# EAGLE design ALog-BottleLogger (EAGLE 9.1.3)

## Sheet 1 of 7: MAIN
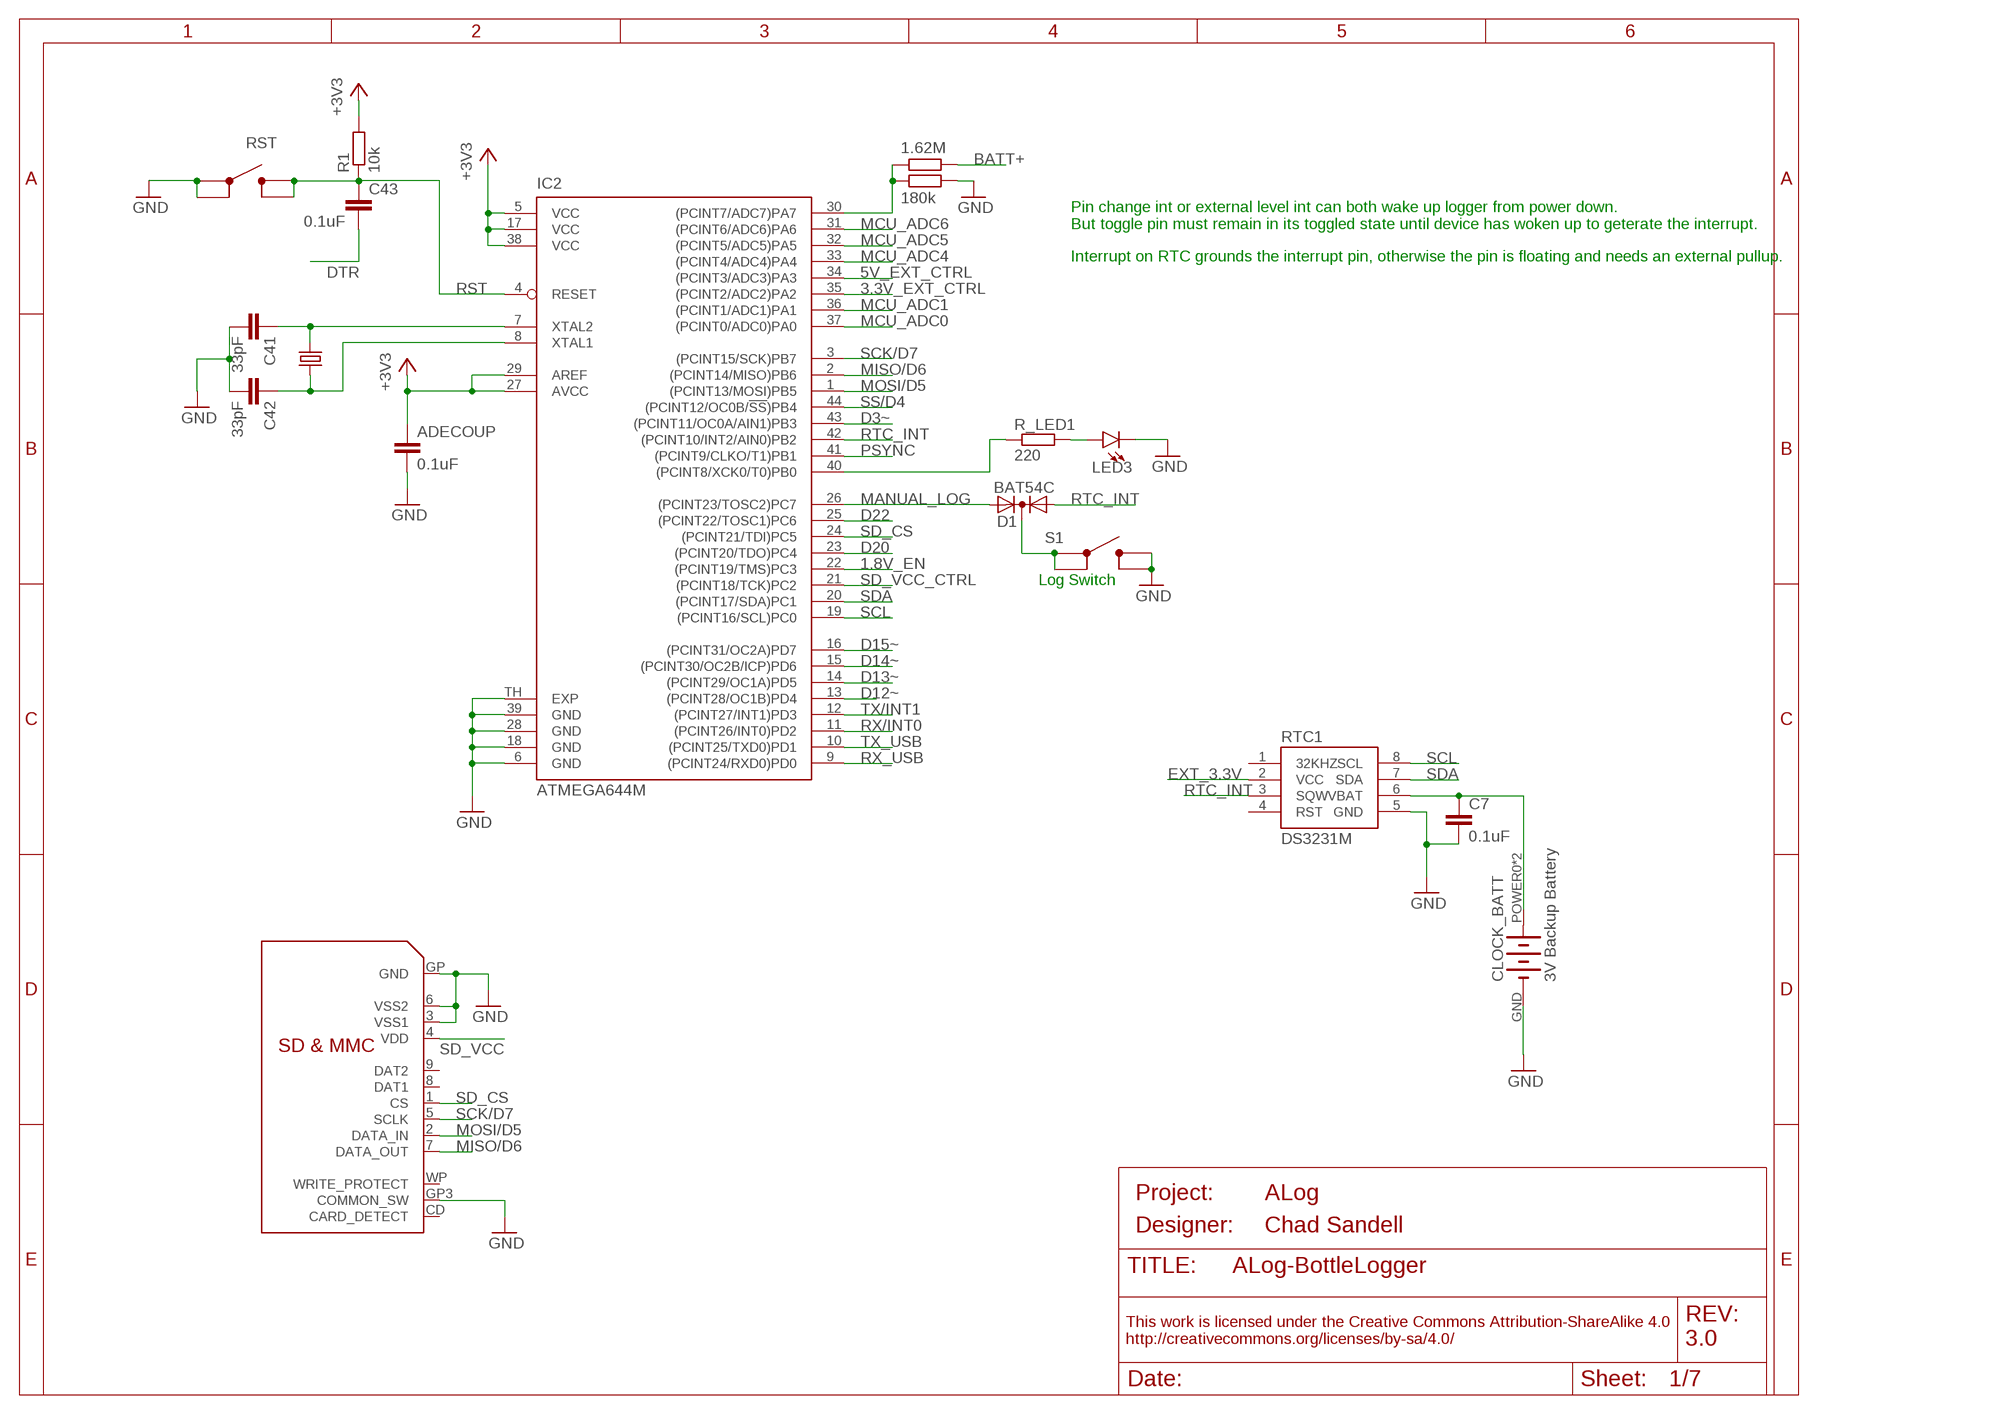
[diagram p0: schematic, sheet 1]
FRAME1 (FRAME_A_L): DESIGNER: Chad Sandell; PROJECT: ALog; REV: 3.0

### Parts
ADECOUP  0.1uF  C-EU0.1UFC0603  [C0603]
C7  0.1uF  C-EU0.1UFC0603  [C0603]
C41  33pF  C-EUC0603  [C0603]
C42  33pF  C-EUC0603  [C0603]
C43  0.1uF  C-EU0.1UFC0603  [C0603]
CLOCK_BATT  3V Backup Battery  LINX-BAT-HLD-012-SMT-OTL  [LINX_BAT-HLD-012-SMT]
D1  BAT54C  DIODE_AC-CA_  [SOT23C]
IC2  ATMEGA644M  [MLF44-TH]
LED3  LED1206  [LED-1206]
Q3  CRYSTALHC49UP  [HC49UP]
R1  10k  R-EU_10KR0603  [R0603]
R18  1.62M  R-EU_1.62MR0603  [R0603]
R19  180k  R-EU_180KR0603  [R0603]
R_LED1  220  R-EU_R0603  [R0603]
RTC1  DS3231M  [SO08]
S1  SWITCHC&K_400GF  [SWITCH_4.2X3.2]
SD  SDMMC06132  [06132]
U$4  SWITCHC&K_400GF  [SWITCH_4.2X3.2]

### Nets
1.8V_EN: IC2.22((PCINT19/TMS)PC3) ; also sheet 3
3.3V_EXT_CTRL: IC2.35((PCINT2/ADC2)PA2) ; also sheet 5
5V_EXT_CTRL: IC2.34((PCINT3/ADC3)PA3) ; also sheet 5
+3V3: ADECOUP.1 IC2.5(VCC) IC2.17(VCC) IC2.27(AVCC) IC2.29(AREF) IC2.38(VCC) R1.2 ; also sheet 3,5,6,7
ADC16: IC2.30((PCINT7/ADC7)PA7) R18.1 R19.1
BATT+: R18.2 ; also sheet 3,6
D3~: IC2.43((PCINT11/OC0A/AIN1)PB3) ; also sheet 6
D12~: IC2.13((PCINT28/OC1B)PD4) ; also sheet 6
D13~: IC2.14((PCINT29/OC1A)PD5) ; also sheet 6
D14~: IC2.15((PCINT30/OC2B/ICP)PD6) ; also sheet 6
D15~: IC2.16((PCINT31/OC2A)PD7) ; also sheet 6
D20: IC2.23((PCINT20/TDO)PC4)
D22: IC2.25((PCINT22/TOSC1)PC6)
DTR: C43.2 ; also sheet 4
EXT_3.3V: RTC1.2(VCC) ; also sheet 5,6
GND: ADECOUP.2 C7.2 C41.2 C42.2 CLOCK_BATT.GND(-) IC2.6(GND) IC2.18(GND) IC2.28(GND) IC2.39(GND) IC2.TH(EXP) LED3.C R19.2 RTC1.5(GND) S1.P$3 S1.P$4 SD.3(VSS1) SD.6(VSS2) SD.GP3(COMMON_SW) SD.GP(GND) U$4.P$1 U$4.P$2 ; also sheet 2,3,4,5,6,7
LED+1: LED3.A R_LED1.2
MANUAL_LOG: D1.2(A2) IC2.26((PCINT23/TOSC2)PC7)
MCU_ADC0: IC2.37((PCINT0/ADC0)PA0) ; also sheet 6
MCU_ADC1: IC2.36((PCINT1/ADC1)PA1)
MCU_ADC4: IC2.33((PCINT4/ADC4)PA4)
MCU_ADC5: IC2.32((PCINT5/ADC5)PA5)
MCU_ADC6: IC2.31((PCINT6/ADC6)PA6)
MISO/D6: IC2.2((PCINT14/MISO)PB6) SD.7(DATA_OUT) ; also sheet 6
MOSI/D5: IC2.1((PCINT13/MOSI)PB5) SD.2(DATA_IN) ; also sheet 6
N$5: IC2.40((PCINT8/XCK0/T0)PB0) R_LED1.1
N$37: C7.1 CLOCK_BATT.POWER0(+) CLOCK_BATT.POWER1(+) RTC1.6(VBAT)
N$39: D1.3(K) S1.P$1 S1.P$2
PSYNC: IC2.41((PCINT9/CLKO/T1)PB1) ; also sheet 3
RST: C43.1 IC2.4(RESET) R1.1 U$4.P$3 U$4.P$4 ; also sheet 6
RTC_INT: D1.1(A1) IC2.42((PCINT10/INT2/AIN0)PB2) RTC1.3(SQW)
RX/INT0: IC2.11((PCINT26/INT0)PD2) ; also sheet 6
RX_USB: IC2.9((PCINT24/RXD0)PD0) ; also sheet 4
SCK/D7: IC2.3((PCINT15/SCK)PB7) SD.5(SCLK) ; also sheet 6
SCL: IC2.19((PCINT16/SCL)PC0) RTC1.8(SCL) ; also sheet 6,7
SD_CS: IC2.24((PCINT21/TDI)PC5) SD.1(CS)
SD_VCC: SD.4(VDD) ; also sheet 5
SD_VCC_CTRL: IC2.21((PCINT18/TCK)PC2) ; also sheet 5
SDA: IC2.20((PCINT17/SDA)PC1) RTC1.7(SDA) ; also sheet 6,7
SS/D4: IC2.44((PCINT12/OC0B/!SS!)PB4) ; also sheet 6
TX/INT1: IC2.12((PCINT27/INT1)PD3) ; also sheet 6
TX_USB: IC2.10((PCINT25/TXD0)PD1) ; also sheet 4
XTAL1: C42.1 IC2.8(XTAL1) Q3.1
XTAL2: C41.1 IC2.7(XTAL2) Q3.2
Unconnected: RTC1.1(32KHZ) RTC1.4(RST) SD.8(DAT1) SD.9(DAT2) SD.CD(CARD_DETECT) SD.WP(WRITE_PROTECT)

### Notes on the sheet
- Pin change int or external level int can both wake up logger from power down.  
  But toggle pin must remain in its toggled state until device has woken up to geterate the interrupt.
- Interrupt on RTC grounds the interrupt pin, otherwise the pin is floating and needs an external pullup.
- Log Switch

## Sheet 2 of 7: ADC REFERENCE
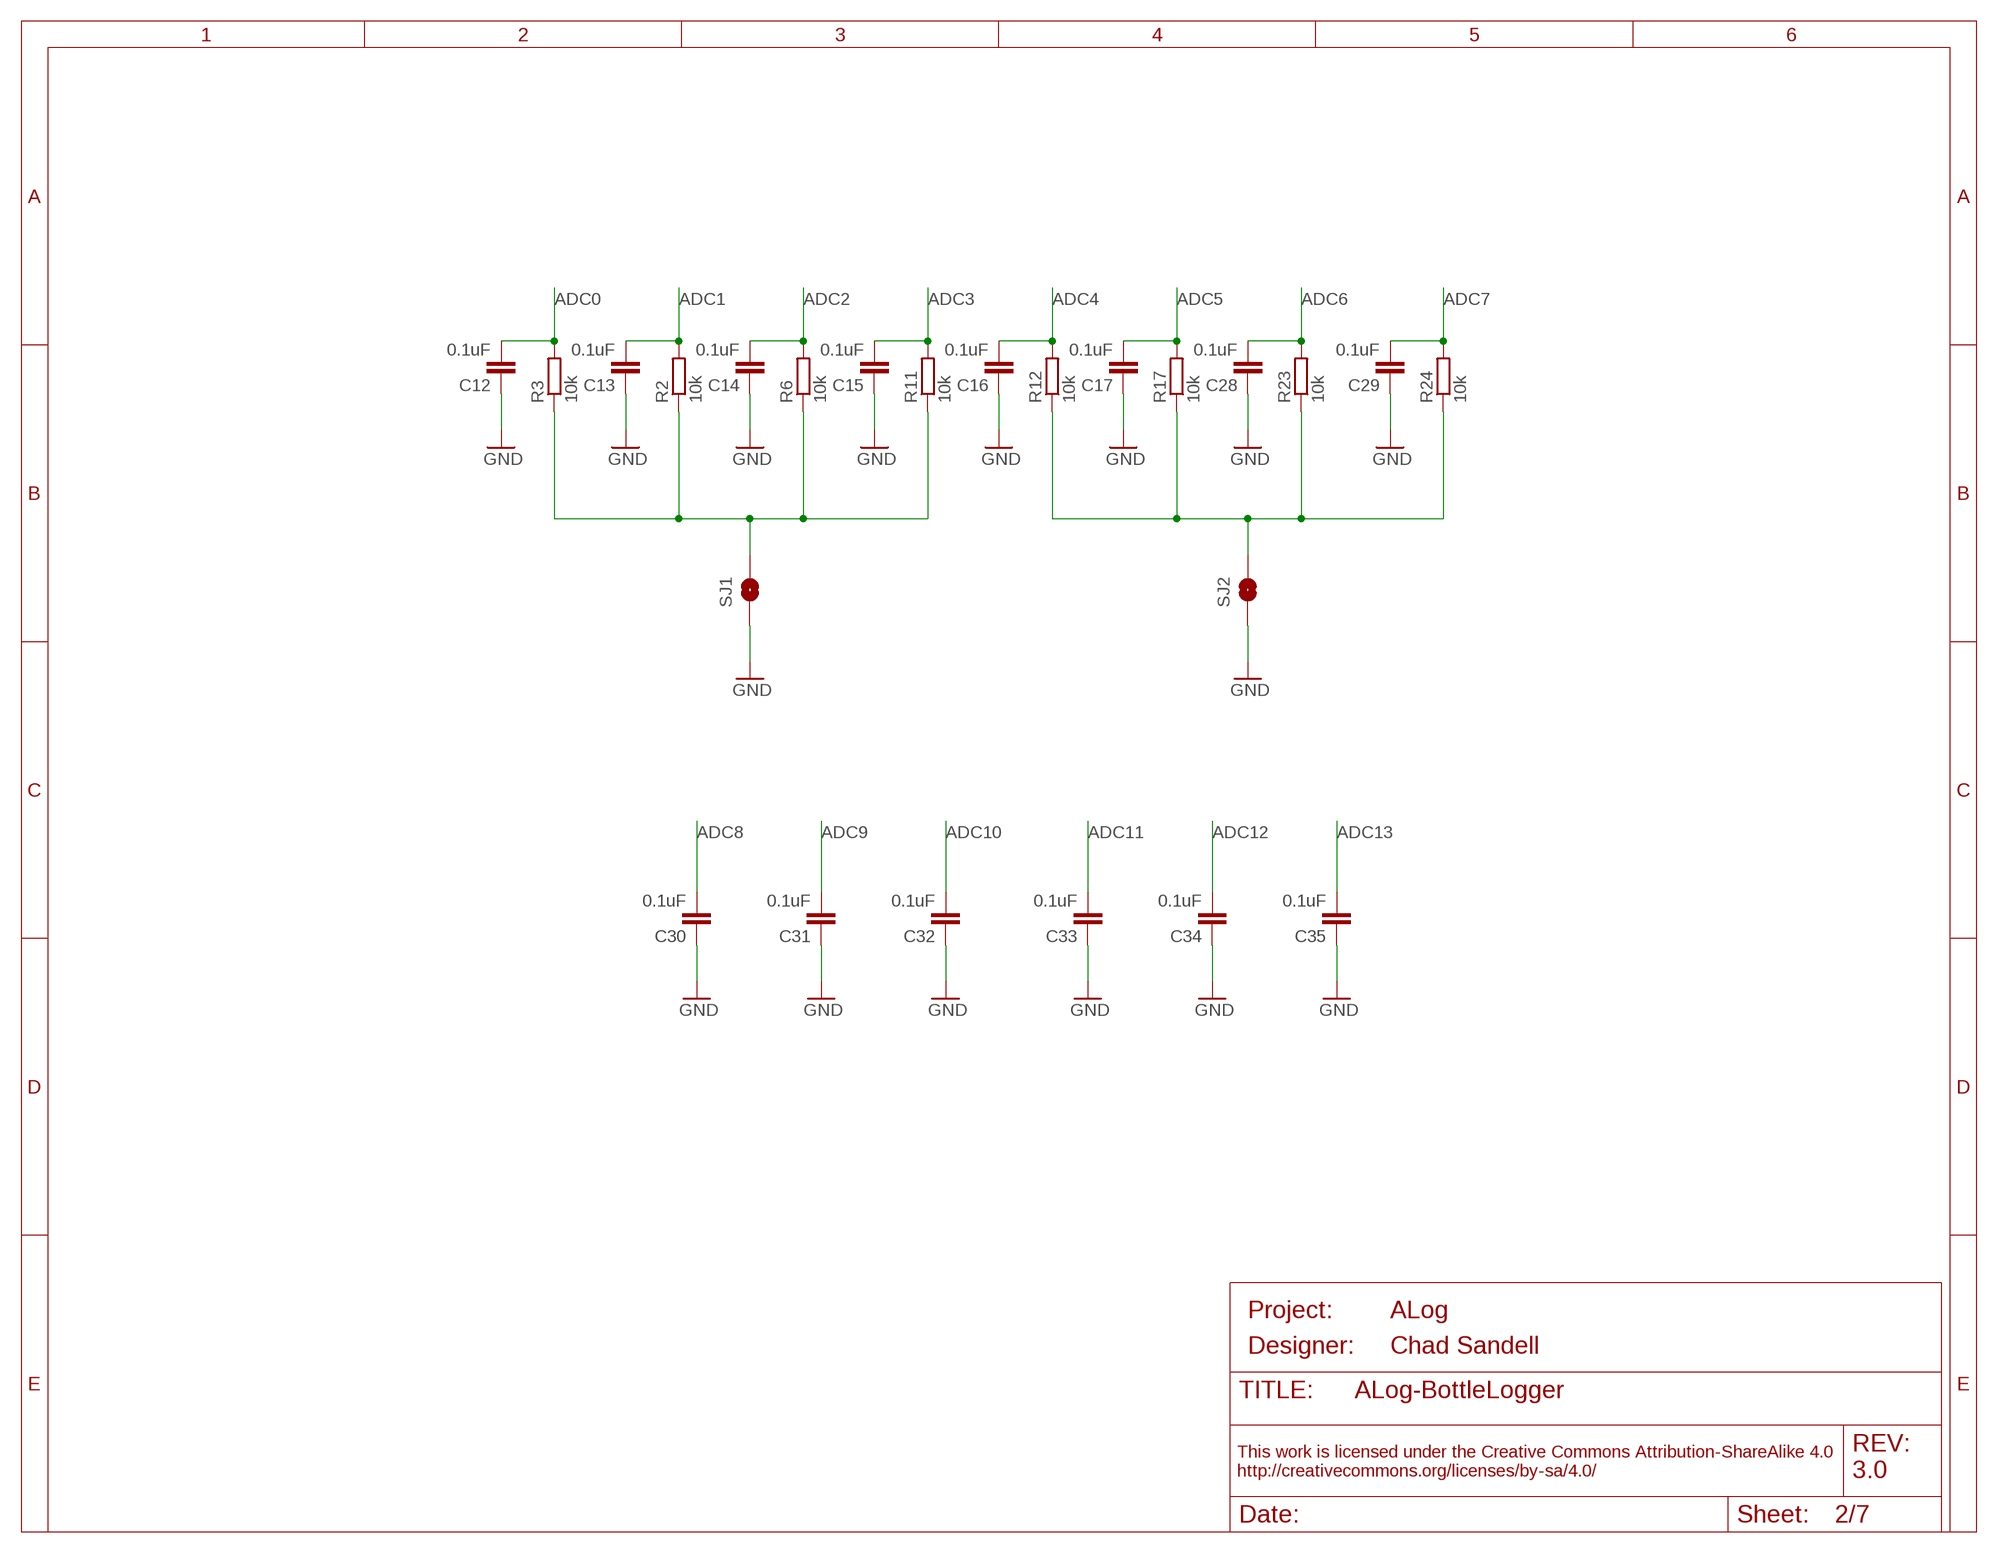
[diagram p1: schematic, sheet 2]
FRAME2 (FRAME_A_L): DESIGNER: Chad Sandell; PROJECT: ALog; REV: 3.0

### Parts
C12  0.1uF  C-EUC0603  [C0603]
C13  0.1uF  C-EU0.1UFC0603  [C0603]
C14  0.1uF  C-EUC0603  [C0603]
C15  0.1uF  C-EU0.1UFC0603  [C0603]
C16  0.1uF  C-EU0.1UFC0603  [C0603]
C17  0.1uF  C-EU0.1UFC0603  [C0603]
C28  0.1uF  C-EU0.1UFC0603  [C0603]
C29  0.1uF  C-EU0.1UFC0603  [C0603]
C30  0.1uF  C-EU0.1UFC0603  [C0603]
C31  0.1uF  C-EU0.1UFC0603  [C0603]
C32  0.1uF  C-EU0.1UFC0603  [C0603]
C33  0.1uF  C-EU0.1UFC0603  [C0603]
C34  0.1uF  C-EU0.1UFC0603  [C0603]
C35  0.1uF  C-EU0.1UFC0603  [C0603]
R2  10k  R-EU_10KR0603  [R0603]
R3  10k  R-EU_10KR0603  [R0603]
R6  10k  R-EU_10KR0603  [R0603]
R11  10k  R-EU_10KR0603  [R0603]
R12  10k  R-EU_10KR0603  [R0603]
R17  10k  R-EU_10KR0603  [R0603]
R23  10k  R-EU_10KR0603  [R0603]
R24  10k  R-EU_10KR0603  [R0603]
SJ1  SOLDERJUMPER-OLDTRACE  [SJ_2S-TRACE]
SJ2  SOLDERJUMPER-OLDTRACE  [SJ_2S-TRACE]

### Nets
ADC0: C12.2 R3.2 ; also sheet 6,7
ADC1: C13.2 R2.2 ; also sheet 6,7
ADC2: C14.2 R6.2 ; also sheet 6,7
ADC3: C15.2 R11.2 ; also sheet 6,7
ADC4: C16.2 R12.2 ; also sheet 6,7
ADC5: C17.2 R17.2 ; also sheet 6,7
ADC6: C28.2 R23.2 ; also sheet 6,7
ADC7: C29.2 R24.2 ; also sheet 6,7
ADC8: C30.2 ; also sheet 6,7
ADC9: C31.2 ; also sheet 6,7
ADC10: C32.2 ; also sheet 6,7
ADC11: C33.2 ; also sheet 6,7
ADC12: C34.2 ; also sheet 6,7
ADC13: C35.2 ; also sheet 6,7
GND: C12.1 C13.1 C14.1 C15.1 C16.1 C17.1 C28.1 C29.1 C30.1 C31.1 C32.1 C33.1 C34.1 C35.1 SJ1.1 SJ2.1 ; also sheet 1,3,4,5,6,7
N$18: R12.1 R17.1 R23.1 R24.1 SJ2.2
N$24: R2.1 R3.1 R6.1 R11.1 SJ1.2

## Sheet 3 of 7: POWER REGULATION
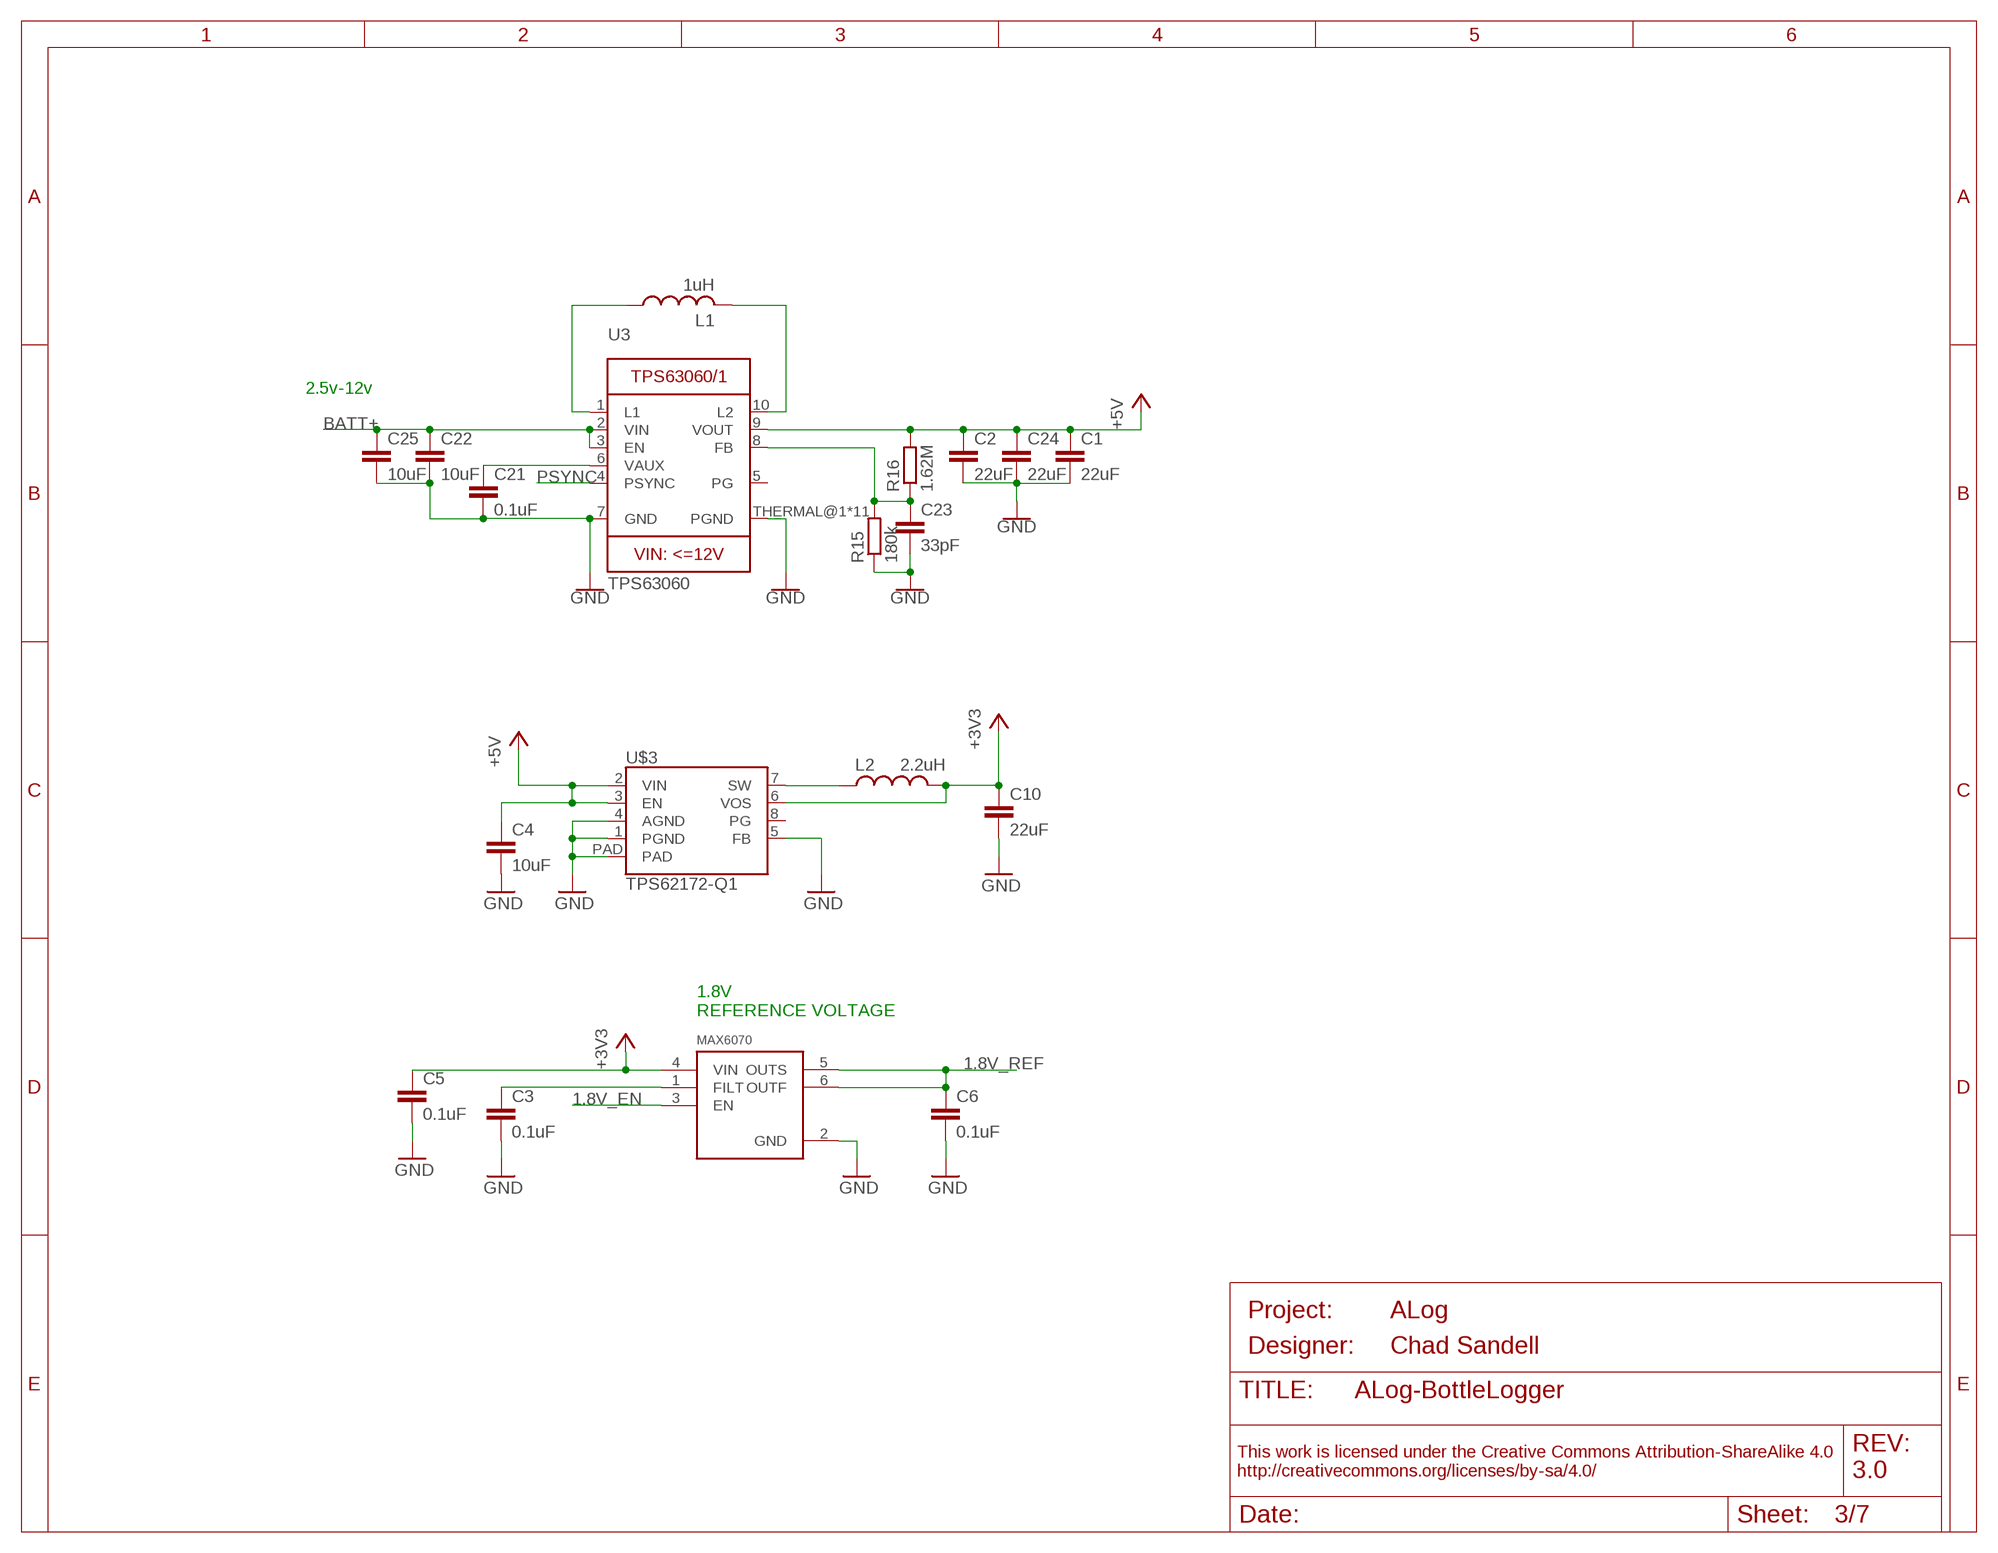
[diagram p2: schematic, sheet 3]
FRAME3 (FRAME_A_L): DESIGNER: Chad Sandell; PROJECT: ALog; REV: 3.0

### Parts
C1  22uF  C-EU22UFC0805  [C0805]
C2  22uF  C-EU22UFC0805  [C0805]
C3  0.1uF  C-EU0.1UFC0603  [C0603]
C4  10uF  C-EU10UFC0805  [C0805]
C5  0.1uF  C-EUC0603  [C0603]
C6  0.1uF  C-EUC0603  [C0603]
C10  22uF  C-EU22UFC0805  [C0805]
C21  0.1uF  C-EUC0603  [C0603]
C22  10uF  C-EU10UFC0805  [C0805]
C23  33pF  C-EUC0603  [C0603]
C24  22uF  C-EU22UFC0805  [C0805]
C25  10uF  C-EU10UFC0805  [C0805]
L1  1uH  WE-MAIA(INDUCTOR)  [WE-MAIA(4.1X4.1)]
L2  2.2uH  INDUCTOR0806  [0806]
R15  180k  R-EU_180KR0603  [R0603]
R16  1.62M  R-EU_1.62MR0603  [R0603]
U3  TPS63060  [PWSON-N10]
U$2  MAX6070AAUT18  [SOT23-6L]
U$3  TPS62172-Q1  [WSON-8-PAD]

### Nets
1.8V_EN: U$2.3(EN) ; also sheet 1
1.8V_REF: C6.1 U$2.5(OUTS) U$2.6(OUTF) ; also sheet 7
+3V3: C5.1 C10.1 L2.P$2 U$2.4(VIN) U$3.6(VOS) ; also sheet 1,5,6,7
+5V: C1.1 C2.1 C4.1 C24.1 R16.2 U3.9(VOUT) U$3.2(VIN) U$3.3(EN) ; also sheet 4,5,7
BATT+: C22.1 C25.1 U3.2(VIN) U3.3(EN) ; also sheet 1,6
GND: C1.2 C2.2 C3.2 C4.2 C5.2 C6.2 C10.2 C21.2 C22.2 C23.2 C24.2 C25.2 R15.1 U3.7(GND) U3.THERMAL@1(PGND) U3.THERMAL@5(PGND) U3.THERMAL@6(PGND) U3.THERMAL@7(PGND) U3.THERMAL@8(PGND) U3.THERMAL@9(PGND) U3.THERMAL@10(PGND) U3.THERMAL@11(PGND) U3.THERMAL@12(PGND) U3.THERMAL@13(PGND) U3.THERMAL@14(PGND) U$2.2(GND) U$3.1(PGND) U$3.4(AGND) U$3.5(FB) U$3.PAD ; also sheet 1,2,4,5,6,7
N$1: L2.P$1 U$3.7(SW)
N$21: C21.1 U3.6(VAUX)
N$22: C23.1 R15.2 R16.1 U3.8(FB)
N$27: L1.P$1 U3.1(L1)
N$32: L1.P$2 U3.10(L2)
N$40: C3.1 U$2.1(FILT)
PSYNC: U3.4(PSYNC) ; also sheet 1
Unconnected: U3.5(PG) U$3.8(PG)

### Notes on the sheet
- 2.5v-12v
- 1.8V
  REFERENCE VOLTAGE

## Sheet 4 of 7: USB
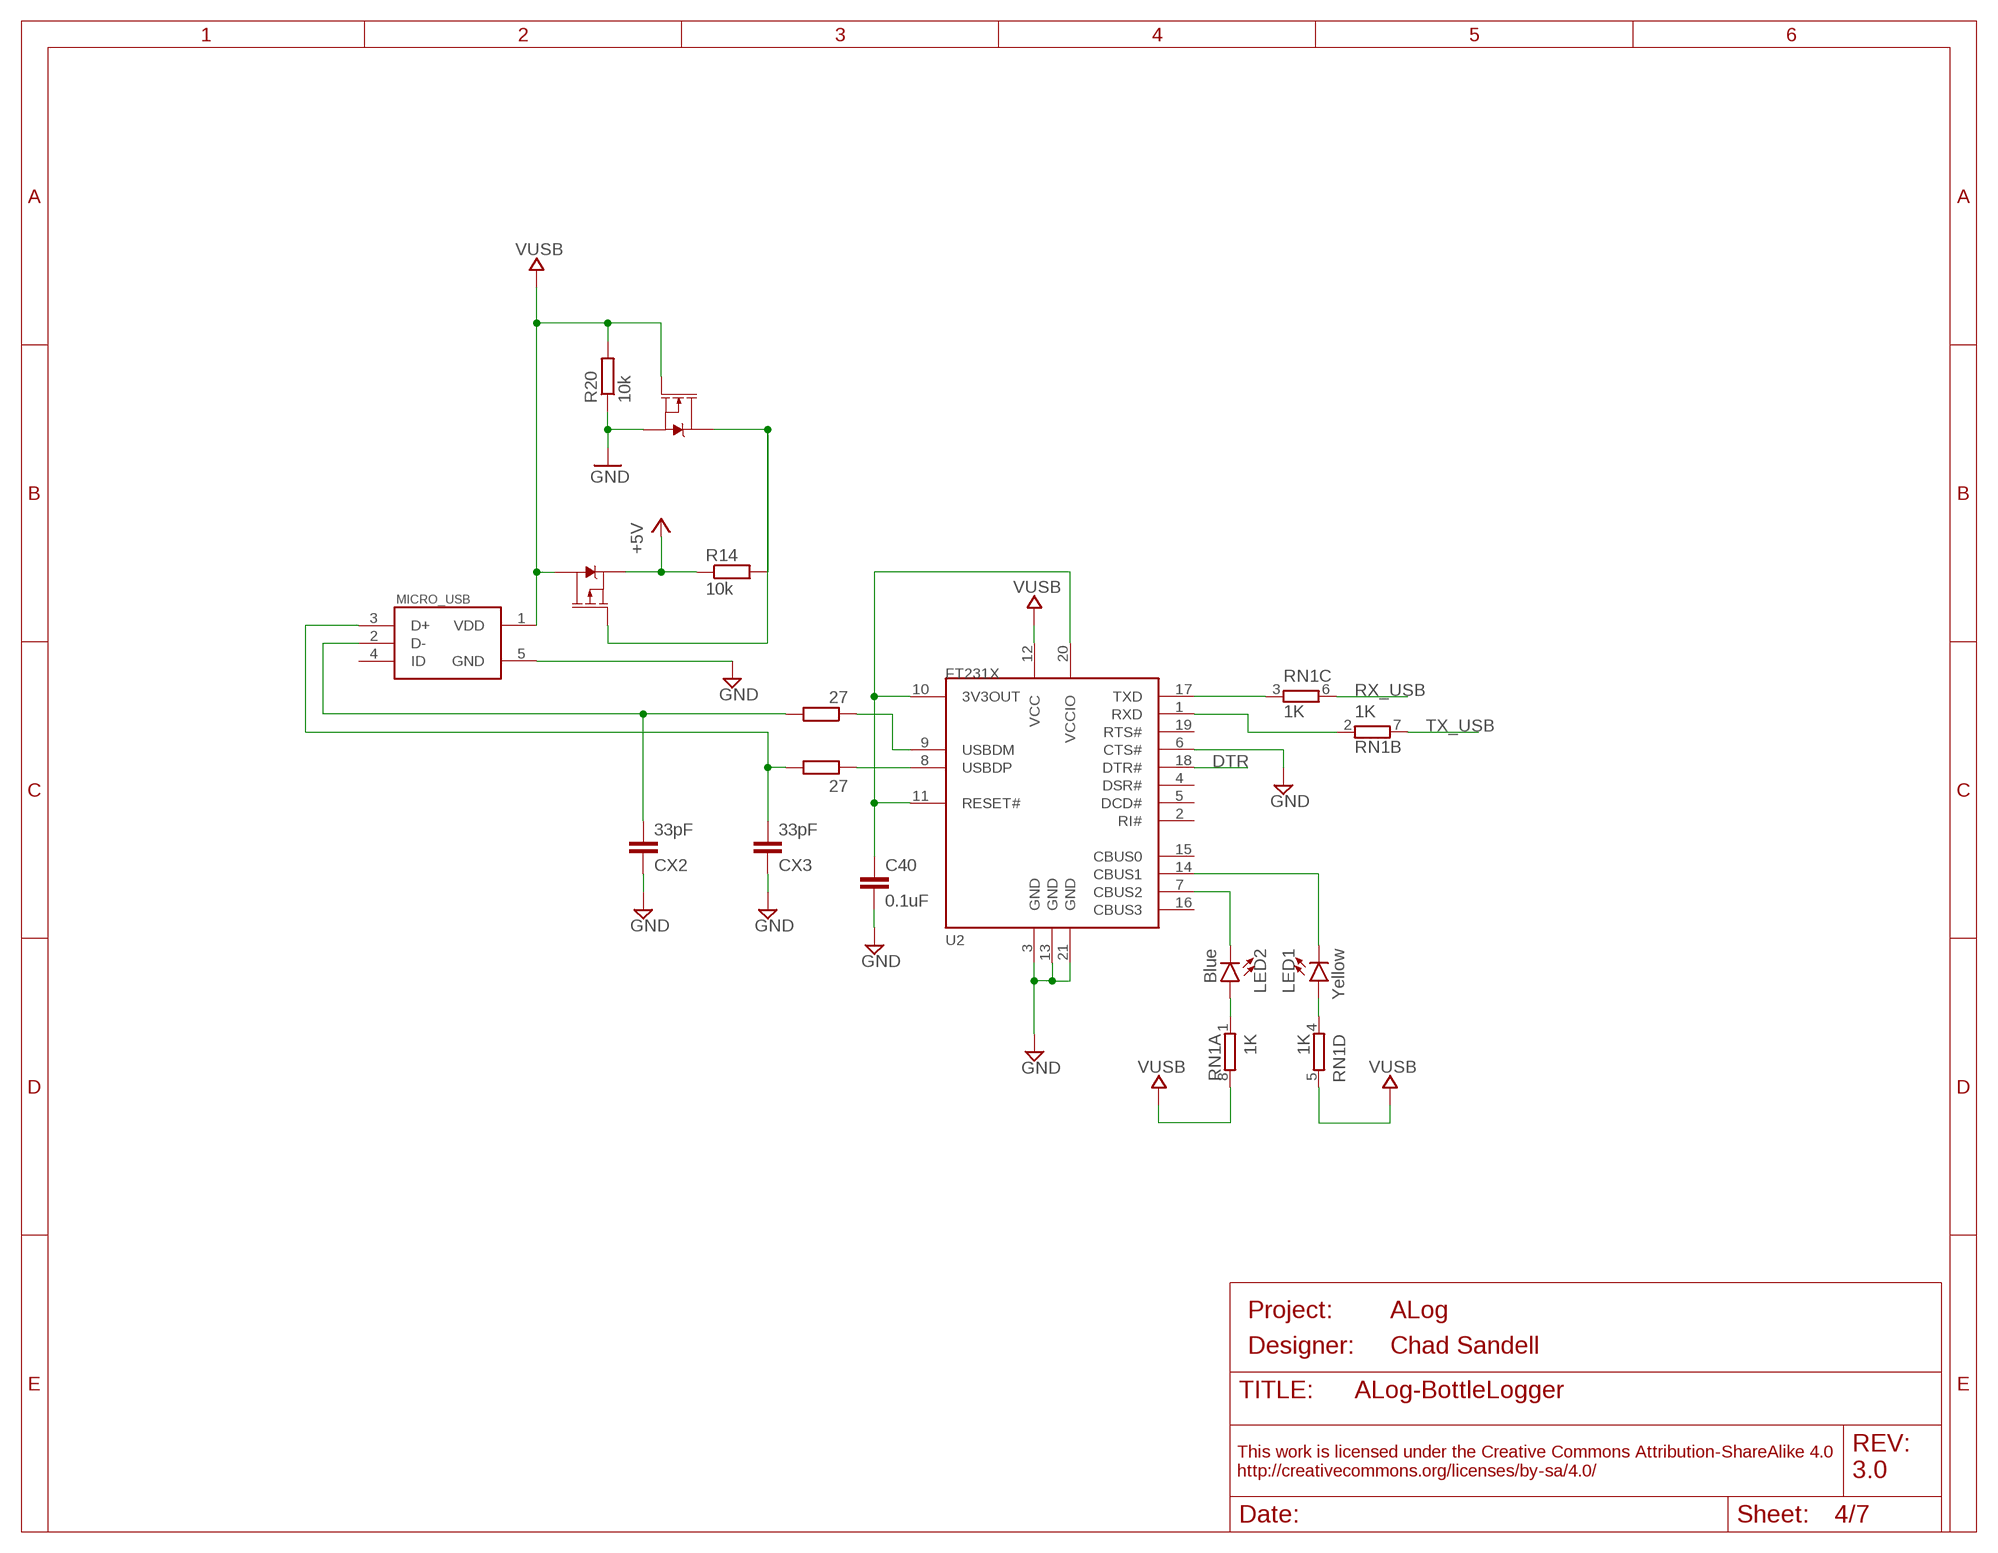
[diagram p3: schematic, sheet 4]
FRAME4 (FRAME_A_L): DESIGNER: Chad Sandell; PROJECT: ALog; REV: 3.0

### Parts
C40  0.1uF  C-EU0.1UFC0603  [C0603]
CX2  33pF  C-EUC0603  [C0603]
CX3  33pF  C-EUC0603  [C0603]
D+  27  R-EU_27R0603  [R0603]
D-  27  R-EU_27R0603  [R0603]
LED1  Yellow  LED0603  [LED-0603]
LED2  Blue  LED0603  [LED-0603]
MICRO_USB  MICRO_USB_LONGPADS  [10118194-0001LF_10118194-0001LF_LONGER_PADS]
Q11  310mA/60V/1.6Ω  MOSFET-NCH-2N7002PW  [SOT323]
Q12  FDN360P  MOSFET_PCH-FDN360P  [SOT23-3]
R14  10k  R-EU_R0603  [R0603]
R20  10k  R-EU_R0603  [R0603]
RN1  1K  4R-N0603-ARC  [0603-ARC]
U2  FT231X-Q  [QFN20]

### Nets
+5V: Q12.2(S) R14.1 ; also sheet 3,5,7
DTR: U2.18(DTR#) ; also sheet 1
GND: C40.2 CX2.1 CX3.1 MICRO_USB.5(GND) Q11.2(S) R20.1 U2.3(GND) U2.6(CTS#) U2.13(GND) U2.21(GND) ; also sheet 1,2,3,5,6,7
N$2: LED2.A RN1.1
N$3: LED1.A RN1.4
N$4: RN1.3 U2.17(TXD)
N$11: Q11.3(D) Q12.1(G) R14.2
N$25: CX3.2 D+.2 MICRO_USB.3(D+)
N$26: CX2.2 D-.2 MICRO_USB.2(D-)
N$28: D+.1 U2.8(USBDP)
N$29: RN1.2 U2.1(RXD)
N$30: C40.1 U2.10(3V3OUT) U2.11(RESET#) U2.20(VCCIO)
N$33: LED2.C U2.7(CBUS2)
N$35: LED1.C U2.14(CBUS1)
N$36: D-.1 U2.9(USBDM)
RX_USB: RN1.6 ; also sheet 1
TX_USB: RN1.7 ; also sheet 1
VUSB: MICRO_USB.1(VDD) Q11.1(G) Q12.3(D) R20.2 RN1.5 RN1.8 U2.12(VCC)
Unconnected: MICRO_USB.4(ID) U2.2(RI#) U2.4(DSR#) U2.5(DCD#) U2.15(CBUS0) U2.16(CBUS3) U2.19(RTS#)

## Sheet 5 of 7: POWER CONTROL
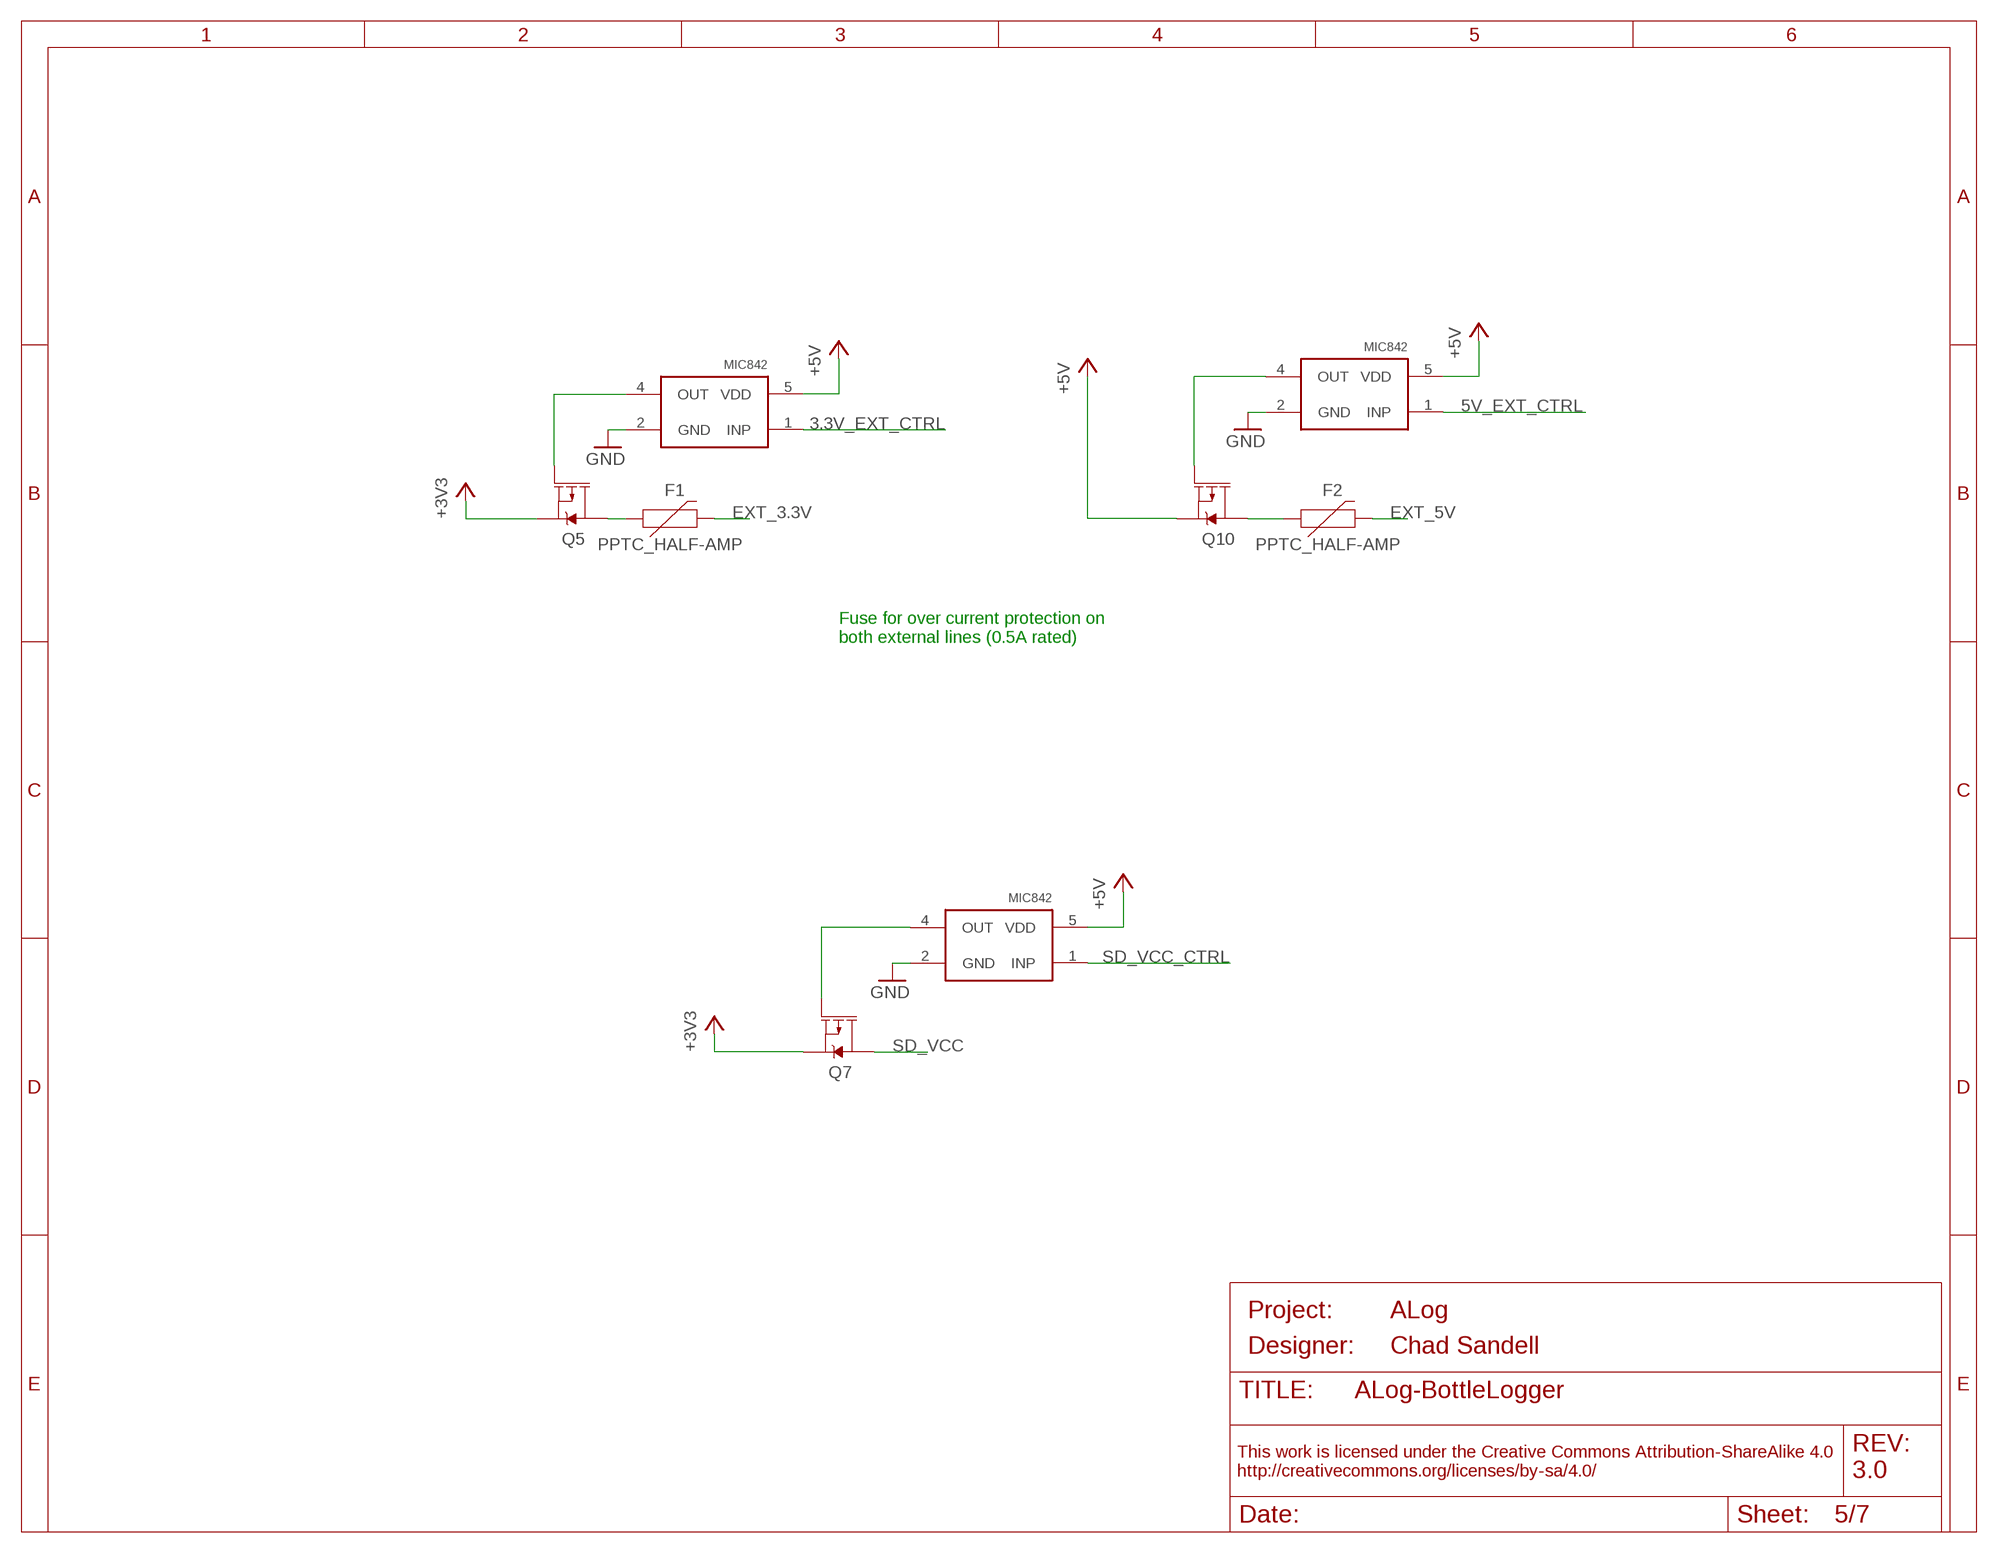
[diagram p4: schematic, sheet 5]
FRAME5 (FRAME_A_L): DESIGNER: Chad Sandell; PROJECT: ALog; REV: 3.0

### Parts
F1  PPTC_HALF-AMP  [1206]
F2  PPTC_HALF-AMP  [1206]
Q5  FDN360P  MOSFET_PCH-FDN360P  [SOT23-3]
Q7  FDN360P  MOSFET_PCH-FDN360P  [SOT23-3]
Q10  FDN360P  MOSFET_PCH-FDN360P  [SOT23-3]
U$1  MIC842  [DCK_R-PDSO-G5]
U$12  MIC842  [DCK_R-PDSO-G5]
U$16  MIC842  [DCK_R-PDSO-G5]

### Nets
3.3V_EXT_CTRL: U$12.1(INP) ; also sheet 1
5V_EXT_CTRL: U$1.1(INP) ; also sheet 1
+3V3: Q5.2(S) Q7.2(S) ; also sheet 1,3,6,7
+5V: Q10.2(S) U$1.5(VDD) U$12.5(VDD) U$16.5(VDD) ; also sheet 3,4,7
EXT_3.3V: F1.2 ; also sheet 1,6
EXT_5V: F2.2 ; also sheet 6,7
GND: U$1.2(GND) U$12.2(GND) U$16.2(GND) ; also sheet 1,2,3,4,6,7
N$6: Q5.1(G) U$12.4(OUT)
N$14: Q10.1(G) U$1.4(OUT)
N$17: F1.1 Q5.3(D)
N$19: Q7.1(G) U$16.4(OUT)
N$20: F2.1 Q10.3(D)
SD_VCC: Q7.3(D) ; also sheet 1
SD_VCC_CTRL: U$16.1(INP) ; also sheet 1

### Notes on the sheet
- Fuse for over current protection on
  both external lines (0.5A rated)

## Sheet 6 of 7: PORTS
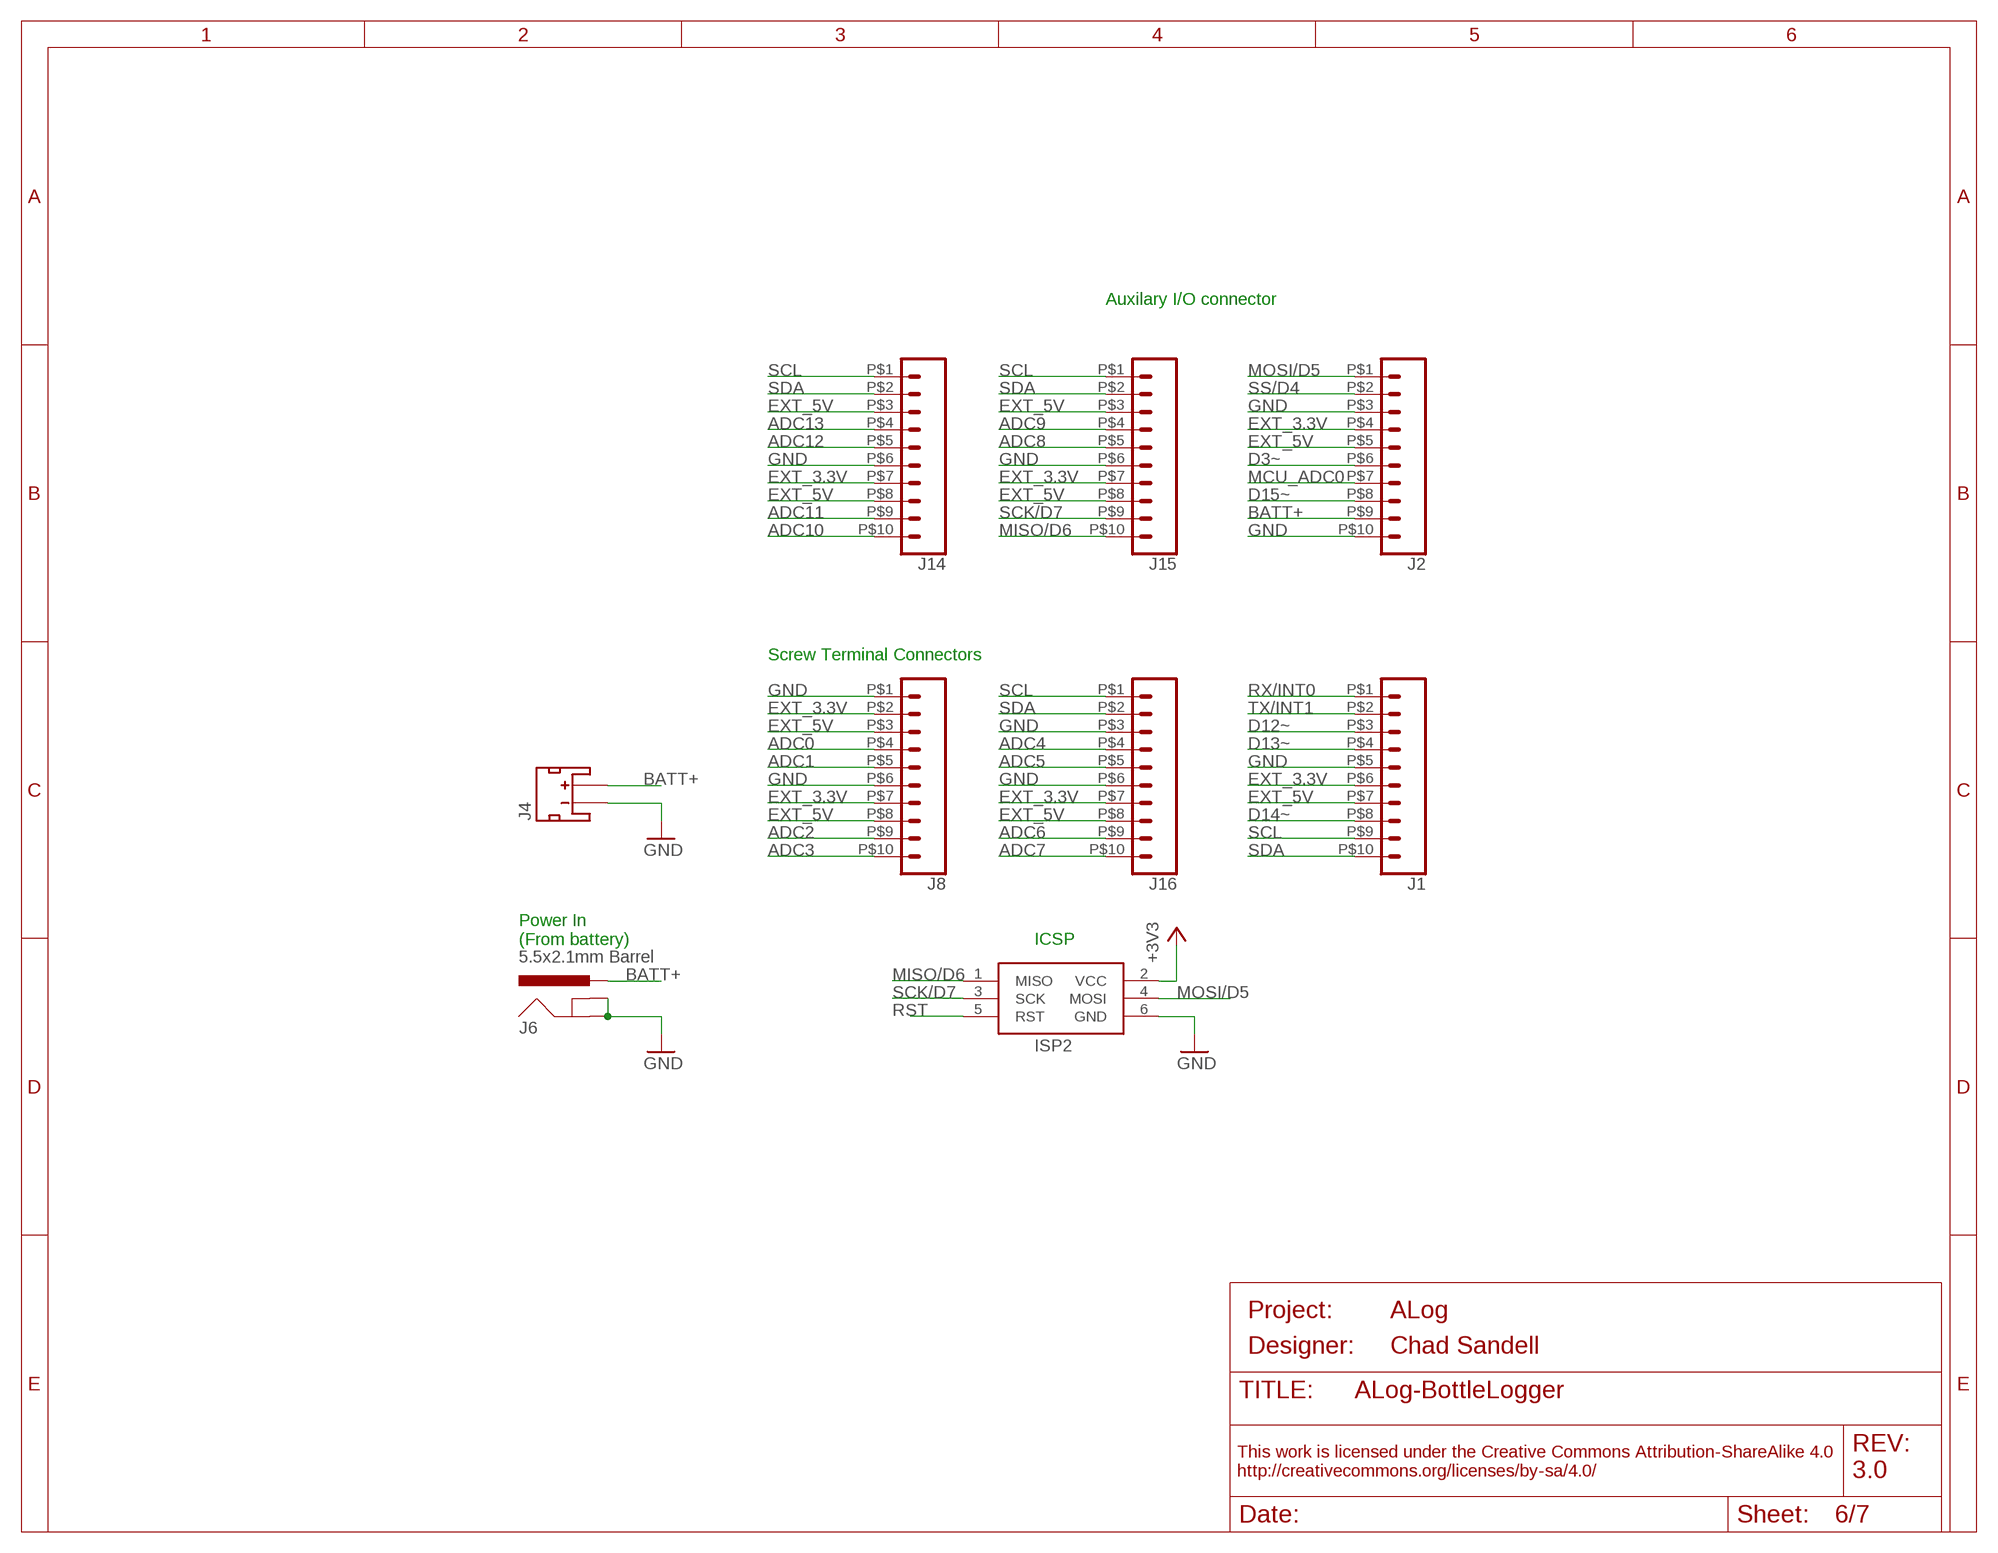
[diagram p5: schematic, sheet 6]
FRAME6 (FRAME_A_L): DESIGNER: Chad Sandell; PROJECT: ALog; REV: 3.0

### Parts
ISP2  AVRISP-6  [AVRISP]
J1  CONN_103.5MM  [1X10_3.5MM_SCREW]
J2  CONN_103.5MM  [1X10_3.5MM_SCREW]
J4  JST_2MM_MALE  [JST-2-SMD]
J6  5.5x2.1mm Barrel  POWER_JACKSMD  [POWER_JACK_SMD]
J8  CONN_103.5MM  [1X10_3.5MM_SCREW]
J14  CONN_103.5MM  [1X10_3.5MM_SCREW]
J15  CONN_103.5MM  [1X10_3.5MM_SCREW]
J16  CONN_103.5MM  [1X10_3.5MM_SCREW]

### Nets
+3V3: ISP2.2(VCC) ; also sheet 1,3,5,7
ADC0: J8.P$4 ; also sheet 2,7
ADC1: J8.P$5 ; also sheet 2,7
ADC2: J8.P$9 ; also sheet 2,7
ADC3: J8.P$10 ; also sheet 2,7
ADC4: J16.P$4 ; also sheet 2,7
ADC5: J16.P$5 ; also sheet 2,7
ADC6: J16.P$9 ; also sheet 2,7
ADC7: J16.P$10 ; also sheet 2,7
ADC8: J15.P$5 ; also sheet 2,7
ADC9: J15.P$4 ; also sheet 2,7
ADC10: J14.P$10 ; also sheet 2,7
ADC11: J14.P$9 ; also sheet 2,7
ADC12: J14.P$5 ; also sheet 2,7
ADC13: J14.P$4 ; also sheet 2,7
BATT+: J2.P$9 J4.2(+) J6.VIN0(PWR) ; also sheet 1,3
D3~: J2.P$6 ; also sheet 1
D12~: J1.P$3 ; also sheet 1
D13~: J1.P$4 ; also sheet 1
D14~: J1.P$8 ; also sheet 1
D15~: J2.P$8 ; also sheet 1
EXT_3.3V: J1.P$6 J2.P$4 J8.P$2 J8.P$7 J14.P$7 J15.P$7 J16.P$7 ; also sheet 1,5
EXT_5V: J1.P$7 J2.P$5 J8.P$3 J8.P$8 J14.P$3 J14.P$8 J15.P$3 J15.P$8 J16.P$8 ; also sheet 5,7
GND: ISP2.6(GND) J1.P$5 J2.P$3 J2.P$10 J4.1(-) J6.GND(GNDBREAK) J6.P$4(GND) J8.P$1 J8.P$6 J14.P$6 J15.P$6 J16.P$3 J16.P$6 ; also sheet 1,2,3,4,5,7
MCU_ADC0: J2.P$7 ; also sheet 1
MISO/D6: ISP2.1(MISO) J15.P$10 ; also sheet 1
MOSI/D5: ISP2.4(MOSI) J2.P$1 ; also sheet 1
RST: ISP2.5(RST) ; also sheet 1
RX/INT0: J1.P$1 ; also sheet 1
SCK/D7: ISP2.3(SCK) J15.P$9 ; also sheet 1
SCL: J1.P$9 J14.P$1 J15.P$1 J16.P$1 ; also sheet 1,7
SDA: J1.P$10 J14.P$2 J15.P$2 J16.P$2 ; also sheet 1,7
SS/D4: J2.P$2 ; also sheet 1
TX/INT1: J1.P$2 ; also sheet 1
Unconnected: J4.NC1(PAD1) J4.NC2(PAD2)

### Notes on the sheet
- Auxilary I/O connector
- Screw Terminal Connectors
- Power In
  (From battery)
- ICSP

## Sheet 7 of 7: ADC
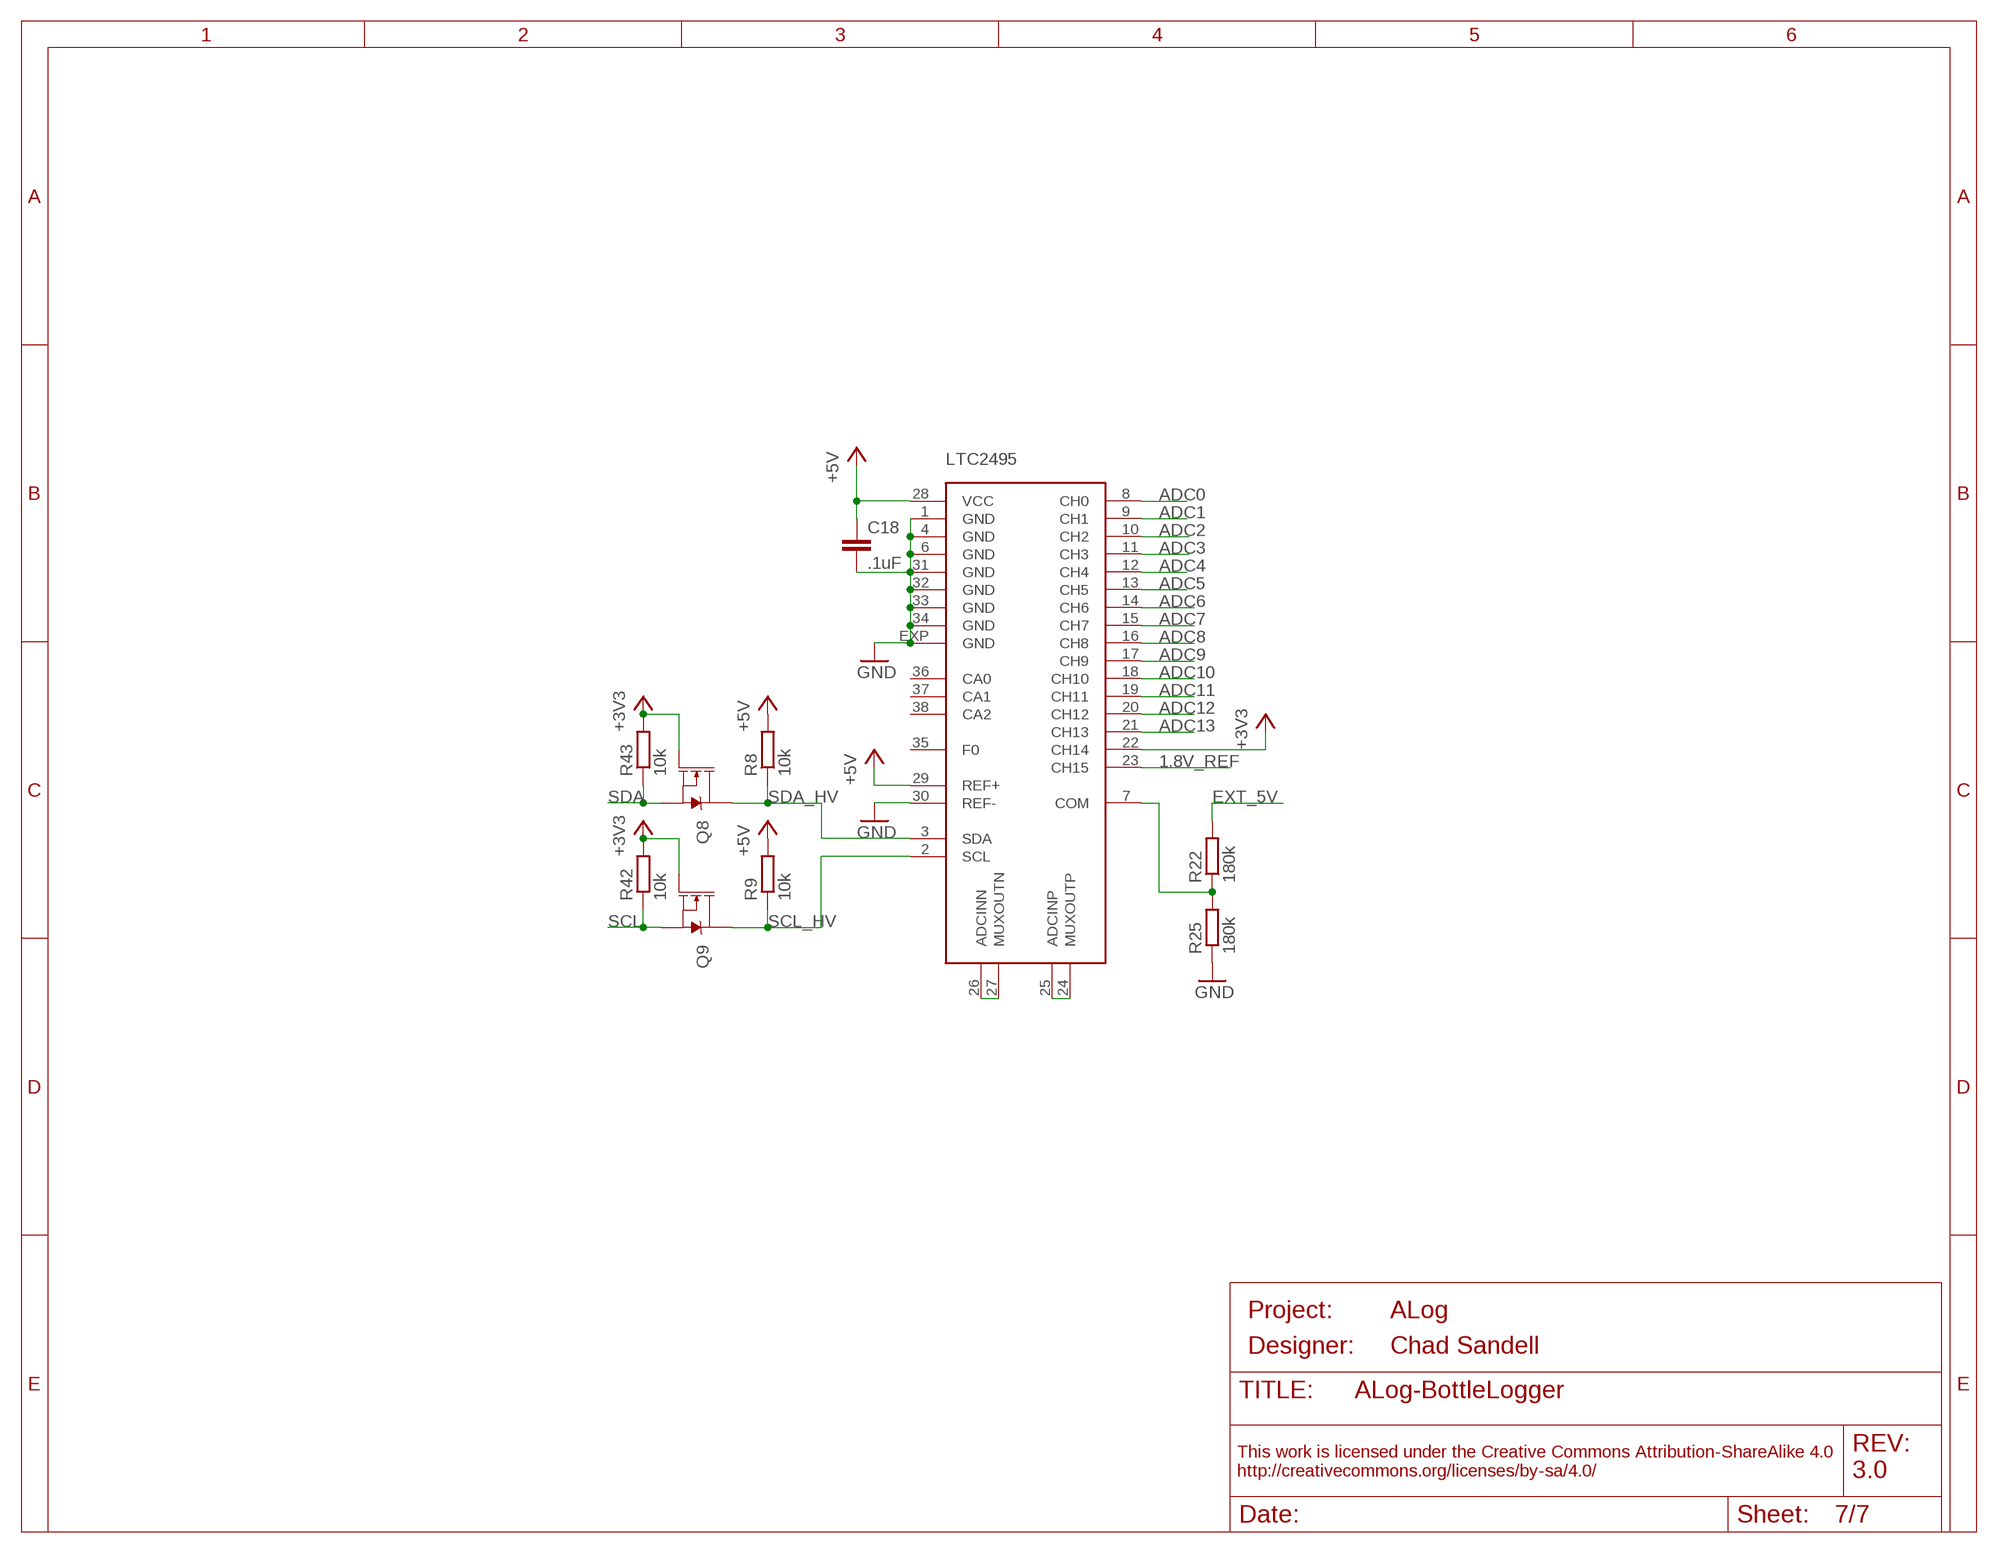
[diagram p6: schematic, sheet 7]
FRAME7 (FRAME_A_L): DESIGNER: Chad Sandell; PROJECT: ALog; REV: 3.0

### Parts
C18  .1uF  C-EU0.1UFC0603  [C0603]
Q8  310mA/60V/1.6Ω  MOSFET-NCH-2N7002PW  [SOT323]
Q9  2N7002  MOSFET-NCH-2N7002PW  [SOT323]
R8  10k  R-EU_10KR0603  [R0603]
R9  10k  R-EU_10KR0603  [R0603]
R22  180k  R-EU_180KR0603  [R0603]
R25  180k  R-EU_180KR0603  [R0603]
R42  10k  R-EU_R0603  [R0603]
R43  10k  R-EU_10KR0603  [R0603]
U$7  LTC2495  [QFN38-5X7]

### Nets
1.8V_REF: U$7.23(CH15) ; also sheet 3
+3V3: Q8.1(G) Q9.1(G) R42.2 R43.2 U$7.22(CH14) ; also sheet 1,3,5,6
+5V: C18.1 R8.2 R9.2 U$7.28(VCC) U$7.29(REF+) ; also sheet 3,4,5
ADC0: U$7.8(CH0) ; also sheet 2,6
ADC1: U$7.9(CH1) ; also sheet 2,6
ADC2: U$7.10(CH2) ; also sheet 2,6
ADC3: U$7.11(CH3) ; also sheet 2,6
ADC4: U$7.12(CH4) ; also sheet 2,6
ADC5: U$7.13(CH5) ; also sheet 2,6
ADC6: U$7.14(CH6) ; also sheet 2,6
ADC7: U$7.15(CH7) ; also sheet 2,6
ADC8: U$7.16(CH8) ; also sheet 2,6
ADC9: U$7.17(CH9) ; also sheet 2,6
ADC10: U$7.18(CH10) ; also sheet 2,6
ADC11: U$7.19(CH11) ; also sheet 2,6
ADC12: U$7.20(CH12) ; also sheet 2,6
ADC13: U$7.21(CH13) ; also sheet 2,6
EXT_5V: R22.2 ; also sheet 5,6
GND: C18.2 R25.1 U$7.1(GND) U$7.4(GND) U$7.6(GND) U$7.30(REF-) U$7.31(GND) U$7.32(GND) U$7.33(GND) U$7.34(GND) U$7.EXP(GND) ; also sheet 1,2,3,4,5,6
N$16: R22.1 R25.2 U$7.7(COM)
N$52: U$7.24(MUXOUTP) U$7.25(ADCINP)
N$130: U$7.26(ADCINN) U$7.27(MUXOUTN)
SCL: Q9.2(S) R42.1 ; also sheet 1,6
SCL_HV: Q9.3(D) R9.1 U$7.2(SCL)
SDA: Q8.2(S) R43.1 ; also sheet 1,6
SDA_HV: Q8.3(D) R8.1 U$7.3(SDA)
Unconnected: U$7.35(F0) U$7.36(CA0) U$7.37(CA1) U$7.38(CA2)

## Library data of the parts
ADECOUP C3 C7 C13 C15-C18 C28-C35 C40 C43 = bschulz_passives:C-EU: CAPACITOR, European symbol; DIGIKEY: 1276-1005-1-ND; MF: Samsung; MPN: CL10B104KO8NNNC
C1 C2 C10 C24 = bschulz_passives:C-EU: CAPACITOR, European symbol; DIGIKEY: 1276-6687-1-ND; MF: Samsung; MPN: CL21A226KQCLRNC
C4 C22 C25 = bschulz_passives:C-EU: CAPACITOR, European symbol; DIGIKEY: 1276-2405-1-ND; MF: Samsung; MPN: CL21A106KQCLRNC
C5 C6 C12 C14 C21 C23 C41 C42 = rcl:C-EU: CAPACITOR, European symbol; SPICEPREFIX: C
CLOCK_BATT = awickert:LINX-BAT-HLD-012-SMT-OTL
CX2 CX3 = resistor:C-EU: CAPACITOR, European symbol
D1 = semicon-smd-ipc:DIODE_AC-CA_: DUAL DIODE
D+ D- = bschulz_passives:R-EU_: RESISTOR, European symbol; DIGIKEY: 311-27.0HRCT-ND; MF: Yageo; MPN: RC0603FR-0727RL; VALUE_PART: 27
F1 F2 = bschulz:PPTC: Resettable Fuse PPTC Resettable Fuse. Really a sort of resistor with a polymeric positive temperature coefficient whose resistance increases dramatically with an increase in temperature. When heated by the power passing through the resistance rises causing the current to be limited, protecting the circuit. This is achieved by the transition of the polymer from a crystalline to an amorphous state where the conductive carbon separates breaking the conductive pathways found in the cool crystalline structure. When a PPTC cools back down it resumes conducting letting the circuit turn back on. SparkFun Products: SparkFun RedBoard - Programmed with Arduino <https://www.sparkfun.com/products/12757> Pro Micro - 5V/16MHz <https://www.sparkfun.com/products/12640> Arduino Pro 328 - 5V/16MHz <https://www.sparkfun.com/products/10915> MP3 Trigger <https://www.sparkfun.com/products/13720>; DIGIKEY: MF-NSMF020-2CT-ND; MF: Bourns; MPN: MF-NSMF020-2
IC2 = bschulz:ATMEGA644*: 8-bit Microcontroller with 64K Bytes In-System Programmable Flash Source: http://www.atmel.com/dyn/resources/prod_documents/doc2593.pdf; DIGIKEY: ATMEGA644PA-MURCT-ND; MF: Atmel; MPN: ATMEGA644PA-MUR; OC_FARNELL: 1748528; OC_NEWARK: 26R5636
ISP2 = adafruit:AVRISP: AVR ISP HEADER Standard 6 pin header for AVR programming
J1 J2 J8 J14-J16 = bschulz:CONN_10: Multi connection point. Often used as Generic Header-pin footprint for 0.1 inch spaced/style header connections On any of the 0.1 inch spaced packages, you can populate with these: Break Away Headers - Straight <https://www.sparkfun.com/products/116> (PRT-00116) Break Away Male Headers - Right Angle <https://www.sparkfun.com/products/553> (PRT-00553) Female Headers <https://www.sparkfun.com/products/115> (PRT-00115) Break Away Headers - Machine Pin <https://www.sparkfun.com/products/117> (PRT-00117) Break Away Female Headers - Swiss Machine Pin <https://www.sparkfun.com/products/743> (PRT-00743) Arduino Stackable Header - 10 Pin <https://www.sparkfun.com/products/11376> (PRT-11376) For SCREWTERMINALS and SPRING TERMINALS visit here: Screw Terimnals on SparkFun.com <https://www.sparkfun.com/search/results?term=Screw+Terminals> (5mm/3.5mm/2.54mm spacing) This device is also useful as a general connection point to wire up your design to another part of your project. Our various solder wires solder well into these plated through hole pads. Hook-Up Wire - Assortment (Stranded, 22 AWG) <https://www.sparkfun.com/products/11375> (PRT-11375) Hook-Up Wire - Assortment (Solid Core, 22 AWG) <https://www.sparkfun.com/products/11367> (PRT-11367) View the entire wire category on our website here <https://www.sparkfun.com/categories/141> Special notes: Molex polarized connector foot print use with SKU : PRT-08231 with associated crimp pins and housings. 1MM SMD Version SKU: PRT-10208 NOTES ON THE VARIANTS LOCK and LOCK_LONGPADS... This footprint was designed to help hold the alignment of a through-hole component (i.e. 6-pin header) while soldering it into place. You may notice that each hole has been shifted either up or down by 0.005 of an inch from it's more standard position (which is a perfectly straight line). This slight alteration caused the pins (the squares in the middle) to touch the edges of the holes. Because they are alternating, it causes a "brace" to hold the component in place. 0.005 has proven to be the perfect amount of "off-center" position when using our standard breakaway headers. Although looks a little odd when you look at the bare footprint, once you have a header in there, the alteration is very hard to notice. Also,if you push a header all the way into place, it is covered up entirely on the bottom side.
J4 = bschulz:JST_2MM_MALE: JST 2MM MALE RA CONNECTOR Two pin, compact surface mount connector. Commonly used as a battery input connection point. We really like the solid locking feeling and high current rating on these small connectors. We use these all the time as battery connectors. Mates to single-cell LiPo batteries. Here is the connector we sell at SparkFun: JST Right Angle Connector - White <https://www.sparkfun.com/products/8612> (PRT-08612) Datasheet <http://www.sparkfun.com/datasheets/Prototyping/Connectors/JST-Horizontal.pdf> It was used on these SparkFun products: SparkFun MOSFET Power Controller <https://www.sparkfun.com/products/11214> (PRT-11214) SparkFun Battery Babysitter - LiPo Battery Manager <https://www.sparkfun.com/products/13777> (PRT-13777) And many, many others that required a lipo battery connection.; DIGIKEY: 455-1749-1-ND; MF: JST; MPN: S2B-PH-SM4-TB(LF)(SN)
J6 = bschulz:POWER_JACK: Power Jack Connector This is the standard 5.5mm barrel jack for power. The PTH is the most common, proven, reliable, footprint. The Slot footprint only works if the mill layer is transmitted to the PCB fab house so be warned. Here are the connectors we sell at SparkFun: DC Barrel Power Jack/Connector <https://www.sparkfun.com/products/119> (PRT-00119) DC Barrel Power Jack/Connector (SMD) <https://www.sparkfun.com/products/12748> (PRT-12748) DC Barrel Jack Adapter - Breadboard Compatible <https://www.sparkfun.com/products/10811> (PRT-10811) It is used on this SparkFun product (and many, many others): SparkFun RedBoard - Programmed with Arduino <https://www.sparkfun.com/products/12757> (DEV-12757) Also, if you need a mating power supply or connector, please check these out: Wall Adapter Power Supply - 9VDC 650mA <https://www.sparkfun.com/products/298> (TOL-00298) DC Barrel Jack Adapter - Male <https://www.sparkfun.com/products/10287> (PRT-10287); DIGIKEY: 732-5929-1-ND; MF: Wurth; MPN: 694106106102
L1 = Custom:WE-MAIA(INDUCTOR): Wurth MAIA series inductor (https://www.digikey.com/products/en?FV=ffecb9d7,ffe00047)
L2 = bschulz:INDUCTOR: Genaric indcutor
LED1-LED3 = SparkFun-LED:LED: LED (Generic) Standard schematic elements and footprints for 5mm, 3mm, 1206, and 0603 sized LEDs. Generic LEDs with no color specified.
MICRO_USB = bschulz:MICRO_USB_LONGPADS; DIGIKEY: 609-4618-1-ND; MF: Amphenol; MPN: 10118194-0001LF
Q3 = crystal:CRYSTAL: CRYSTAL; OC_FARNELL: unknown; OC_NEWARK: unknown
Q5 Q7 Q10 Q12 = bschulz:MOSFET_PCH: P-channel MOSFETs Voltage controlled devices that allow control of high current outputs. SparkFun Products: SparkFun ESP32 Thing <https://www.sparkfun.com/products/13907> SparkFun ESP8266 Thing <https://www.sparkfun.com/products/13231>; DIGIKEY: FDN360PCT-ND; MF: Fairchild; MPN: FDN360P
Q8 Q11 = bschulz:MOSFET-NCH: N-channel MOSFETs Voltage controlled devices that allow control of high current outputs. SparkFun Products: SparkFun OpenScale <https://www.sparkfun.com/products/13261> SparkFun Digital Sandbox <https://www.sparkfun.com/products/12651> SparkFun Monster Moto Shield <https://www.sparkfun.com/products/10182> SparkFun MOSFET Power Controller <https://www.sparkfun.com/products/11214>; PROD_ID: TRANS-11151
Q9 = bschulz:MOSFET-NCH: N-channel MOSFETs Voltage controlled devices that allow control of high current outputs. SparkFun Products: SparkFun OpenScale <https://www.sparkfun.com/products/13261> SparkFun Digital Sandbox <https://www.sparkfun.com/products/12651> SparkFun Monster Moto Shield <https://www.sparkfun.com/products/10182> SparkFun MOSFET Power Controller <https://www.sparkfun.com/products/11214>; DIGIKEY: 2N7002W-FDICT-ND; MF: Diodes Incorporated; MPN: 2N7002W-7-F; PROD_ID: TRANS-11151
R1-R3 R6 R8 R9 R11 R12 R17 R23 R24 R43 = bschulz_passives:R-EU_: RESISTOR, European symbol; DIGIKEY: 311-10.0KHRCT-ND; MF: Yageo; MPN: RC0603FR-0710KL; VALUE_PART: 10k
R14 R20 R42 = rcl:R-EU_: RESISTOR, European symbol; SPICEPREFIX: R
R15 R19 R22 = bschulz_passives:R-EU_: RESISTOR, European symbol; DIGIKEY: 311-180KLDCT-ND; MF: Yageo; MPN: AC0603FR-07180KL; VALUE_PART: 180K
R16 R18 = bschulz_passives:R-EU_: RESISTOR, European symbol; DIGIKEY: 541-1.62MHCT-ND; MF: Vishay Dale; MPN: CRCW06031M62FKEA; VALUE_PART: 1.62M
R25 = bschulz_passives:R-EU_: RESISTOR, European symbol; DIGIKEY: 311-180KLDCT-ND; MF: Yageo; MPN: AC0603FR-07180KL; VALUE_PART: 180k
R_LED1 = bschulz_passives:R-EU_: RESISTOR, European symbol
RN1 = resistor-dil:4R-N: Array Chip Resistor Source: RS Component / Phycomp; OC_FARNELL: unknown; OC_NEWARK: unknown
RTC1 = bschulz:DS3231M: DS3231M Real Time Clock Accuracy +/-5ppm. Battery Backup. 2.3V to 5.5V. Datasheet <https://cdn.sparkfun.com/datasheets/Dev/Beagle/DS3231M.pdf> SparkFun Products CryptoCape <https://www.sparkfun.com/products/12773> (DEV-12773) SparkFun CryptoShield <https://www.sparkfun.com/products/13183> (DEV-13183); DIGIKEY: DS3231MZ+-ND; MF: Maxim; MPN: DS3231MZ+
S1 U$4 = bschulz_Old:SWITCH: Genaric SPST Switch; DIGIKEY: CKN10504CT-ND; MF: C&K; MPN: PTS810 SJG 250 SMTR LFS
SD = adafruit:SDMMC: SD MMC Card holder 4UCON part #06132 - easy to solder
SJ1 SJ2 = SparkFun-Retired:SOLDERJUMPER-OLD: Solder Jumper Standard SMD solder jumper. Used to automate production. Two varients : Normally Open and Normally Closed are the same, but have different paste layers. NC will have a large amount of paste and should jumper during reflow.
U2 = bschulz:FT231X: FT231x - USB to UART Bridge Characteristics: Vin: 3.3V ~ 5V Operating Temperature: -40°C to 85°C Digikey: FT231x <https://www.digikey.com/product-detail/en/ftdi-future-technology-devices-international-ltd/FT231XQ-R/768-1128-1-ND/3029153>; DIGIKEY: 768-1128-1-ND; MF: FTDI; MPN: FT231XQ-R
U3 = bschulz:TPS6306*: TPS6306x - Step Up/Down Converter (Buck-Boost) Characteristics: Vin: 2.5V ~ 12V Vout: 2.5V ~ 8V (or 5V fixed) Output Current: 2 A Operating Temperature: -40°C to 85°C Digikey: 296-30205-1-ND, TPS63061 (5V Fixed) <https://www.digikey.com/product-detail/en/texas-instruments/TPS63061DSCR/296-30205-1-ND/2834997> 296-30204-1-ND, TPS63060 (Adjustable) <https://www.digikey.com/product-detail/en/texas-instruments/TPS63060DSCR/296-30204-1-ND/2834996>; DIGIKEY: 296-30204-1-ND; MF: TI; MPN: TPS63060DSCR
U$1 U$12 U$16 = Custom:MIC842: Comparator with internal voltage referance (1.24V), 5V and 3.3V compatable, 20mA output current
U$2 = bschulz:MAX6070AAUT*: MAX6070 Low Noise high precision voltage referance; DIGIKEY: MAX6070BAUT18+TCT-ND; MF: Maxim; MPN: MAX6070BAUT18+T
U$3 = bschulz:TPS6217*-Q1: TPS6217*-Q1 - Step Down Converter (Buck) Characteristics: Vin: 3V ~ 17V Vout: 0.9V ~ 6V (or 1.8, 3.3V fixed) Output Current: 500 mA Operating Temperature: -40°C to 125°C Digikey: TPS62172 (3.3V Fixed) <https://www.digikey.com/product-detail/en/texas-instruments/TPS62172QDSGRQ1/296-40841-1-ND/51787187> TPS62171 (1.8V Fixed) <https://www.digikey.com/product-detail/en/texas-instruments/TPS62171QDSGRQ1/296-45329-1-ND/6609870> TPS62170 (Adjustable) <https://www.digikey.com/product-detail/en/texas-instruments/TPS62170DSGR/296-29865-1-ND/2780971>; DIGIKEY: 296-40841-1-ND; MF: TI; MPN: TPS62172QDSGRQ1
U$7 = bschulz:LTC2495: LTC2495 - Sigma Delta ADC Characteristics: VCC: 2.7~5.5V Operating Temperature: -40°C to 85°C Number of Inputs: 16 (8 Differenital) Sample Rate: 15 Samples Per Second Digikey: LTC2495IUHF#PBF-ND <https://www.digikey.com/product-detail/en/linear-technology/LTC2495IUHF-PBF/LTC2495IUHF-PBF-ND/1468476> Linear Technology <http://www.linear.com/purchase/LTC2495>; DIGIKEY: LTC2495IUHF#PBF-ND; MF: LT; MPN: LTC2495IUHF#PBF

## Net classes
0 default: width 0.203 mm, drill 0.305 mm

## Board
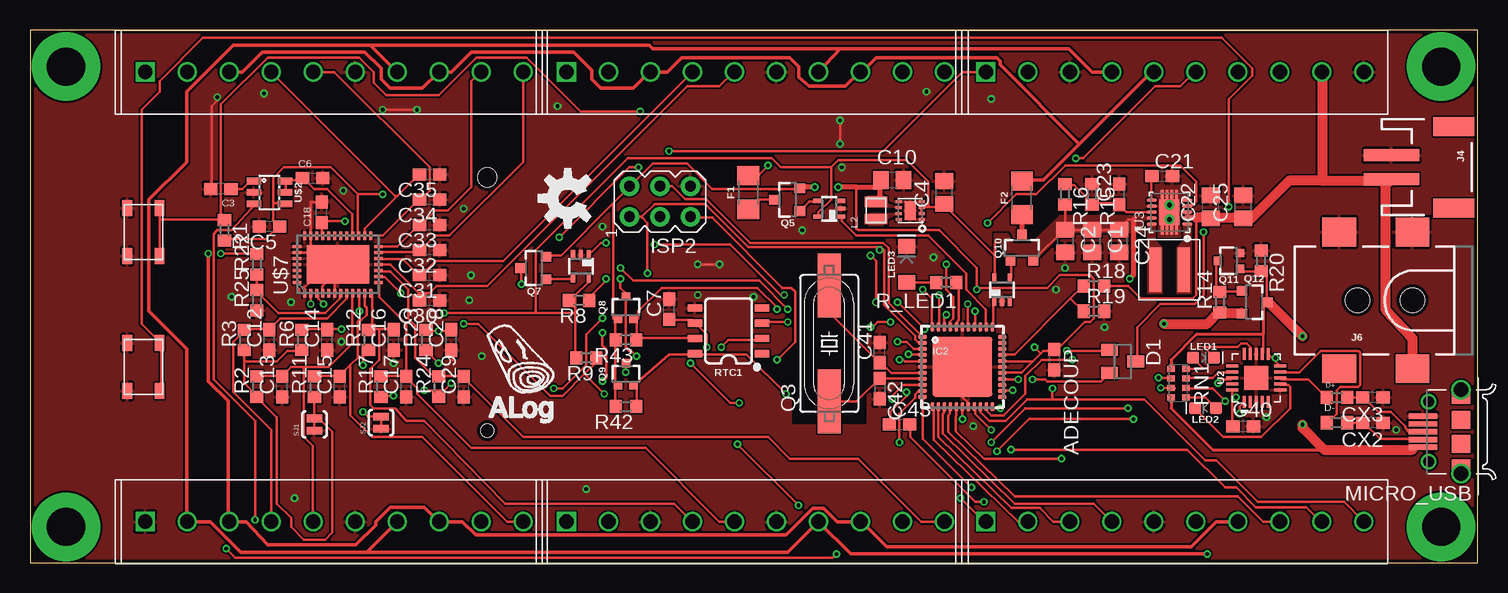
[diagram p7: board, top side]
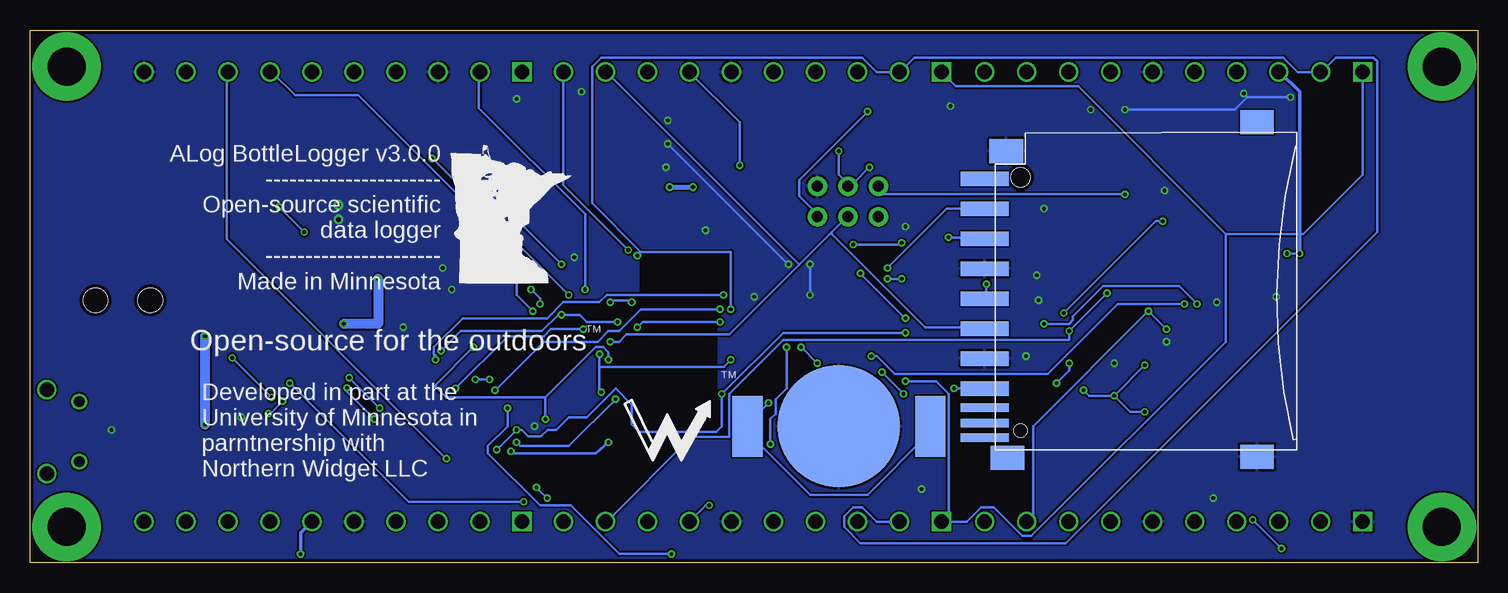
[diagram p8: board, bottom side, seen from below]

Size 120.65 x 44.45 mm. Coordinates in mm from the lower left corner, seen from the top.
Outline: 0,0 120.65,0 120.65,44.45 0,44.45 0,0
Copper layers (1*16): Top 0.035mm / dielectric 1.5mm / Bottom 0.035mm
Design rules "PCB-POOL Standard": minimum track width 0.15mm, minimum drill 0.3mm, track to track 0.15mm, track to pad 0.15mm, pad to pad 0.15mm, via to via 0.15mm, smd to smd 0.15mm, copper to edge 0.3mm, drill to drill 0.2mm, minimum pad ring 0.2mm, minimum via ring 0.15mm, stop-mask expansion 0.075mm, vias tented up to drill 0mil, thermal gap 0.2mm

### Footprints (pad centres in the part's own frame; a part is rotated, then mirrored left to right if it is on the bottom)
C0603 = smd 1.1 x 1: 1 -0.85,0; 2 0.85,0
C0805 = smd 1.3 x 1.5: 1 -0.95,0; 2 0.95,0
LINX_BAT-HLD-012-SMT = smd 10.16 x 10.16: GND 0,0 | smd 2.54 x 5.08: POWER0 -7.62,0; POWER1 7.62,0
SOT23C = smd 1 x 1.4: 1 -0.95,-1.1; 2 0.95,-1.1; 3 0,1.1
R0603 = smd 1 x 1.1: 1 -0.85,0; 2 0.85,0
1206 = smd 1.6 x 1.8: 1 -1.4,0; 2 1.4,0
MLF44-TH = smd 0.7 x 0.3: 1 -3.325,2.5; 2 -3.325,2; 3 -3.325,1.5; 4 -3.325,1; 5 -3.325,0.5; 6 -3.325,0; 7 -3.325,-0.5; 8 -3.325,-1; 9 -3.325,-1.5; 10 -3.325,-2; 11 -3.325,-2.5; 23 3.325,-2.5; 24 3.325,-2; 25 3.325,-1.5; 26 3.325,-1; 27 3.325,-0.5; 28 3.325,0; 29 3.325,0.5; 30 3.325,1; 31 3.325,1.5; 32 3.325,2; 33 3.325,2.5 | smd 0.3 x 0.7: 12 -2.5,-3.325; 13 -2,-3.325; 14 -1.5,-3.325; 15 -1,-3.325; 16 -0.5,-3.325; 17 0,-3.325; 18 0.5,-3.325; 19 1,-3.325; 20 1.5,-3.325; 21 2,-3.325; 22 2.5,-3.325; 34 2.5,3.325; 35 2,3.325; 36 1.5,3.325; 37 1,3.325; 38 0.5,3.325; 39 0,3.325; 40 -0.5,3.325; 41 -1,3.325; 42 -1.5,3.325; 43 -2,3.325; 44 -2.5,3.325 | smd 5 x 5: TH 0,0
AVRISP = drill 0.9 pad 1.626: 1 -1.27,2.54; 2 1.27,2.54; 3 -1.27,0; 4 1.27,0; 5 -1.27,-2.54; 6 1.27,-2.54
1X10_3.5MM_SCREW = drill 1.2 square: P$1 0,0 | drill 1.2: P$2 3.5,0; P$3 7,0; P$4 10.5,0; P$5 14,0; P$6 17.5,0; P$7 21,0; P$8 24.5,0; P$9 28,0; P$10 31.5,0
JST-2-SMD = smd 1 x 4.6: 1 -1,-3.7; 2 1,-3.7 | smd 1.6 x 3.4: NC1 -3.4,1.5; NC2 3.4,1.5
POWER_JACK_SMD = smd 2.8 x 2.4: GND 0,-5.7; P$4 6.1,-5.7; VIN0 0,5.7; VIN1 6.1,5.7 | hole 2.032: 0,0; 4.572,0
WE-MAIA(4.1X4.1) = smd 0.98 x 3.7: P$1 -1.185,0; P$2 1.185,0
0806 = smd 0.85 x 1.9: P$1 -0.725,0; P$2 0.725,0
LED-0603 = smd 1 x 1: A -0.877,0; C 0.877,0
LED-1206 = smd 1.2 x 1.4: A -1.5,0; C 1.5,0
10118194-0001LF_10118194-0001LF_LONGER_PADS = smd 0.45 x 2.35: 1 -1.3,3.175; 2 -0.65,3.175; 3 0,3.175; 4 0.65,3.175; 5 1.3,3.175 | drill 0.9: P$6 -2.5,2.7; P$7 2.5,2.7 | drill 1.2: P$8 -3.5,0; P$9 3.5,0 | smd 1.5 x 1.55: P$10 -1,0; P$11 1,0; P$12 -3.05,0; P$13 3.05,0
HC49UP = smd 5.334 x 1.93: 1 -4.826,0; 2 4.826,0
SOT23-3 = smd 0.8 x 0.9: 1 -0.95,-1; 2 0.95,-1; 3 0,1.1
SOT323 = smd 0.7 x 0.7: 1 -0.65,-0.925; 2 0.65,-0.925; 3 0,0.925
0603-ARC = smd 0.5 x 0.65: 1 -1.2,-0.625; 2 -0.4,-0.625; 3 0.4,-0.625; 4 1.2,-0.625; 5 1.2,0.625; 6 0.4,0.625; 7 -0.4,0.625; 8 -1.2,0.625
SO08 = smd 0.6 x 1.2: 1 -1.905,-2.8; 2 -0.635,-2.8; 3 0.635,-2.8; 4 1.905,-2.8; 5 1.905,2.8; 6 0.635,2.8; 7 -0.635,2.8; 8 -1.905,2.8
SWITCH_4.2X3.2 = smd 1.3 x 0.8: P$1 -2,1.35; P$2 2,1.35; P$3 2,-1.35; P$4 -2,-1.35
06132 = smd 1.2 x 4: 1 6.9,0.9; 2 4.4,0.9; 3 1.9,0.9; 4 -0.6,0.9; 5 -3.1,0.9; 6 -5.6,0.9; 7 -8.1,0.9; 9 9.4,0.9 | smd 0.7 x 4: 8 -9.7,0.9; CD -11,0.9; WP -12.2,0.9 | smd 2 x 2.8: GP -13.8,-21.8; GP2 14.1,-21.8; GP3 11.7,-0.9; GP4 -13.9,-1 | hole 1.1: -11.6,-2.1 | hole 1.6: 9.5,-2.1
SJ_2S-TRACE = smd 0.635 x 1.27: 1 -0.508,0; 2 0.508,0
QFN20 = smd 1 x 0.25: 1 -2.032,0.968; 2 -2.032,0.468; 3 -2.032,-0.032; 4 -2.032,-0.532; 5 -2.032,-1.032; 11 1.968,-1.032; 12 1.968,-0.532; 13 1.968,-0.032; 14 1.968,0.468; 15 1.968,0.968 | smd 0.25 x 1: 6 -1.032,-2.032; 7 -0.532,-2.032; 8 -0.032,-2.032; 9 0.468,-2.032; 10 0.968,-2.032; 16 0.968,1.968; 17 0.468,1.968; 18 -0.032,1.968; 19 -0.532,1.968; 20 -1.032,1.968 | smd 2 x 2: 21 -0.032,-0.032
PWSON-N10 = smd 0.28 x 0.85: 1 -1,-1.475; 2 -0.5,-1.475; 3 0,-1.475; 4 0.5,-1.475; 5 1,-1.475; 6 1,1.475; 7 0.5,1.475; 8 0,1.475; 9 -0.5,1.475; 10 -1,1.475 | smd 2.15 x 1.66: THERMAL@1 0,0 | drill 0.4 pad 0.6: THERMAL@5 -0.6,0; THERMAL@6 0.6,0 | smd 0.8 x 0.23: THERMAL@7 1.46,0.6; THERMAL@8 1.46,0.2; THERMAL@9 1.46,-0.2; THERMAL@10 1.46,-0.6; THERMAL@11 -1.46,-0.6; THERMAL@12 -1.46,-0.2; THERMAL@13 -1.46,0.2; THERMAL@14 -1.46,0.6
DCK_R-PDSO-G5 = smd 0.35 x 0.8: 1 -0.65,-0.95; 2 0,-0.95; 3 0.65,-0.95; 4 0.65,0.95; 5 -0.65,0.95
SOT23-6L = smd 0.55 x 1.2: 1 -0.95,-1.3; 2 0,-1.3; 3 0.95,-1.3; 4 0.95,1.3; 5 0,1.3; 6 -0.95,1.3
WSON-8-PAD = smd 0.25 x 0.5: 1 -0.75,-0.95; 2 -0.25,-0.95; 3 0.25,-0.95; 4 0.75,-0.95; 5 0.75,0.95; 6 0.25,0.95; 7 -0.25,0.95; 8 -0.75,0.95 | smd 1.6 x 0.9: PAD 0,0
QFN38-5X7 = smd 0.7 x 0.25: 1 -2.4,2.75; 2 -2.4,2.25; 3 -2.4,1.75; 4 -2.4,1.25; 5 -2.4,0.75; 6 -2.4,0.25; 7 -2.4,-0.25; 8 -2.4,-0.75; 9 -2.4,-1.25; 10 -2.4,-1.75; 11 -2.4,-2.25; 12 -2.4,-2.75; 20 2.4,-2.75; 21 2.4,-2.25; 22 2.4,-1.75; 23 2.4,-1.25; 24 2.4,-0.75; 25 2.4,-0.25; 26 2.4,0.25; 27 2.4,0.75; 28 2.4,1.25; 29 2.4,1.75; 30 2.4,2.25; 31 2.4,2.75 | smd 0.25 x 0.7: 13 -1.5,-3.4; 14 -1,-3.4; 15 -0.5,-3.4; 16 0,-3.4; 17 0.5,-3.4; 18 1,-3.4; 19 1.5,-3.4; 32 1.5,3.4; 33 1,3.4; 34 0.5,3.4; 35 0,3.4; 36 -0.5,3.4; 37 -1,3.4; 38 -1.5,3.4 | smd 3.2 x 5.2: EXP 0,0

### Placement (x,y rotation side)
ADECOUP  85.35,16.95 270 top
C1  88.5,26.85 270 top
C2  86.25,26.85 270 top
C3  15.9,31.2 180 top
C4  76.2,30.9 90 top
C5  19.95,28.05 180 top
C6  23.55,32.1 0 top
C7  53.25,21.15 90 top
C10  71.85,31.95 0 top
C12  19.95,18.6 90 top
C13  21,14.7 90 top
C14  24.75,18.6 90 top
C15  25.8,14.7 90 top
C16  30.3,18.6 90 top
C17  31.35,14.7 90 top
C18  24.3,29.25 90 top
C21  94.35,32.25 0 top
C22  98.4,29.7 90 top
C23  90.75,30.75 90 top
C24  90.75,26.85 270 top
C25  101.1,29.7 90 top
C28  35.1,18.6 90 top
C29  36.15,14.7 90 top
C30  33.3,21.9 180 top
C31  33.3,24 180 top
C32  33.3,26.1 180 top
C33  33.3,28.2 180 top
C34  33.3,30.3 180 top
C35  33.3,32.4 180 top
C40  101.1,11.4 0 top
C41  70.8,17.55 90 top
C42  70.8,14.55 270 top
C43  72.45,11.55 0 top
CLOCK_BATT  53.25,11.4 180 bottom
CX2  111.9,11.7 180 top
CX3  111.9,13.8 180 top
D1  91.05,16.8 270 top
D+  108.9,13.8 0 top
D-  108.9,11.7 0 top
F1  59.85,30.9 90 top
F2  82.65,30.45 90 top
IC2  77.7,16.35 0 top
ISP2  52.5,30.15 90 top
J1  79.65,3.45 0 top
J2  79.65,40.95 0 top
J4  117.15,33 270 top
J6  115.2,21.9 180 top
J8  9.6,3.45 0 top
J14  9.6,40.95 0 top
J15  44.7,40.95 0 top
J16  44.7,3.45 0 top
L1  94.95,24.45 180 top
L2  70.5,29.4 90 top
LED1  97.8,17.1 0 top
LED2  97.95,12.9 180 top
LED3  73.05,24.9 90 top
LOGO2  OSHW-LOGOM  [OSHW-LOGO-M]  44.81,30.41 90 top
MICRO_USB  119.25,10.95 90 top
Q3  66.6,18.3 90 top
Q5  63.15,30.3 90 top
Q7  42,24.6 90 top
Q8  49.65,21.3 0 top
Q9  49.65,15.75 0 top
Q10  82.65,26.25 0 top
Q11  99.9,25.2 90 top
Q12  102,21.75 270 top
R1  16.2,27.75 270 top
R2  18.9,14.7 90 top
R3  17.85,18.6 90 top
R6  22.65,18.6 90 top
R8  45.75,21.9 180 top
R9  46.35,17.1 180 top
R11  23.7,14.7 90 top
R12  28.2,18.6 90 top
R14  99.15,21.75 90 top
R15  88.5,30.75 270 top
R16  86.25,30.75 270 top
R17  29.25,14.7 90 top
R18  88.65,23.1 0 top
R19  88.65,21 0 top
R20  102.6,25.2 270 top
R22  18.9,24.9 90 top
R23  33,18.6 90 top
R24  34.05,14.7 90 top
R25  18.9,21.9 90 top
R42  49.65,13.05 180 top
R43  49.65,18.6 180 top
R_LED1  76.35,23.4 180 top
RN1  95.7,15 90 top
RTC1  58.2,19.35 90 top
S1  9.45,16.35 270 top
SD  40.2,22.65 90 bottom
SJ1  23.7,11.55 90 top
SJ2  29.25,11.7 90 top
U2  102.15,15.45 90 top
U3  94.95,29.25 90 top
U$1  81,22.8 0 top
U$2  19.95,30.9 270 top
U$3  73.35,29.4 90 top
U$4  9.45,27.6 90 top
U$7  25.65,24.9 90 top
U$12  66.6,29.55 90 top
U$13  [MN_SILK]  77.25,23.25 0 top
U$14  ALOG_LOGO_V1_5.5MM  [ALOG_LOGO_V1_SMALL]  40.96,16.92 0 top
U$15  NWLOGO_MED  [NWLOGO_MED]  67.57,11.49 0 bottom
U$16  45.9,24.75 180 top

### Tracks (layer width: path | path; a pad name or v marks a point on that pad's centre or on a via)
1.8V_EN  (via drill 0.3)
  Top 0.203: v80.85,12.9 80.25,12.9 IC2.22 | v67.2,0.75 66.9,0.45 17.1,0.45 v16.35,1.2 | v18.75,3.6 18.75,11.85 15.3,15.3 15.3,27.45 15.6,27.75 16.8,27.75 18.45,29.55 U$2.3
  Bottom 0.203: v80.85,12.9 80.85,11.4 82.5,9.75 82.5,9.15 78.15,4.8 75.6,4.8 71.55,0.75 v67.2,0.75 | v18.75,3.6 v16.35,1.2
1.8V_REF
  Top 0.203: U$2.5 21.3,30.9 21.3,31.8 U$2.6 21.3,31.95 22.95,31.95 | 22.95,31.95 22.8,32.1 C6.1 22.95,31.95 | 22.95,31.95 23.7,31.2 24.75,31.2 26.85,29.1 26.85,27.3 U$7.23
3.3V_EXT_CTRL
  Top 0.203: IC2.35 79.65,19.8 79.65,21.15 78,22.8 78,24.15 74.85,27.3 68.85,27.3 67.65,28.5 67.65,28.8 U$12.1
5V_EXT_CTRL
  Top 0.203: IC2.34 80.25,19.8 80.25,21.75 U$1.1
+3V3  (via drill 0.3, 0.35)
  Top 0.152: 64.25,31.35 Q5.2
  Top 0.203: 72.15,29.7 72.3,29.7 U$3.6 | 70.8,30.6 L2.P$2 | 27.3,30.75 27.3,27.3 U$7.22 | 27.3,30.75 25.05,33 21.15,33 20.25,32.1 20.25,30 | 20.25,30 20.25,28.5 20.7,28.05 | 20.7,28.05 19.65,27 16.2,27 R1.2 | 20.7,28.05 C5.1 | 20.25,30 21.15,30 U$2.4 | 48.75,18.6 48.75,20.25 Q8.1 48.6,20.4 48.6,30 | 48.9,13.05 R42.2 48.75,13.05 48.75,14.7 Q9.1 48.75,14.85 48.75,18.6 | 48.75,18.6 R43.2 | 48.6,30 49.95,31.35 ISP2.2 50.1,31.5 51.9,33.3 54.75,33.3 56.85,31.2 64.05,31.2 Q5.2 | 48.6,30 44.25,25.65 43.05,25.65 Q7.2 | v29.4,30.75 27.3,30.75 | v77.7,12 IC2.17 | v72.45,16.95 72.75,16.95 72.9,16.8 74.25,16.8 IC2.5 | 84.22,17.48 84.45,17.7 85.35,17.7 ADECOUP.1 85.35,17.85 85.65,17.85 87.9,20.1 88.35,20.1 88.65,20.4 88.65,23.7 88.35,24 85.8,24 84.75,22.95 78.9,22.95 | 84.22,17.48 83.55,16.8 | 83.55,16.8 82.65,15.9 81.15,15.9 IC2.27 | 83.55,16.8 81.15,16.8 IC2.29 | v78.15,21.6 78.15,19.8 IC2.38 | 68.85,31.35 68.85,27.9 69,27.75 75.75,27.75 78.9,24.6 78.9,22.95 | v83.7,18 84.22,17.48 | 78.9,22.95 v78.9,22.8 | 70.8,31.95 70.8,31.35 C10.1 70.8,31.95
  Top 0.406: 70.8,30.6 70.8,31.35 68.85,31.35 v67.35,31.35 | v65.4,31.35 64.25,31.35
  Bottom 0.203: v29.4,30.75 49.95,30.75 49.95,31.35 ISP2.2 | v77.7,12 77.7,13.8 | 77.7,13.8 73.5,18 72.9,18 72.45,17.55 v72.45,16.95 | v78.15,21.6 78.15,22.05 v78.9,22.8 | 77.7,13.8 85.95,13.8 86.85,14.7 86.85,14.85 v83.7,18
  Bottom 0.406: v67.35,31.35 v65.4,31.35
  pour Top (no thermals): 69.9,30.6 71.1,30.6 71.1,30.15 72.15,29.7 69.9,29.7
+5V  (via drill 0.3)
  Top 0.203: 100.95,20.85 Q12.2 | 99.15,20.85 R14.1 99.15,21 | 91.95,28.65 91.5,28.65 90.75,27.9 C24.1 90.75,27.75 88.5,27.75 | U$3.2 74.25,29.25 74.25,29.55 U$3.3 74.4,29.7 74.85,29.7 | 86.25,27.9 Q10.2 | 86.25,27.9 R16.2 | 86.25,27.9 C2.1 86.25,27.75 88.5,27.75 | 88.5,27.75 C1.1 | 80.4,26.7 80.4,25.65 | 80.4,25.65 80.4,23.85 U$1.5 | 74.85,29.7 76.05,29.7 76.2,29.85 | 66.75,33 66.75,30.3 65.7,29.25 65.7,28.95 U$12.5 | 66.75,33 67.35,33.6 73.05,33.6 74.85,31.8 74.85,29.7 | 80.4,25.65 76.2,29.85 | 76.2,29.85 C4.1 | 24.3,27.3 U$7.29 | 24.3,27.3 C18.1 24.3,28.5 v26.25,28.5 | 24.3,27.3 U$7.28 | 45.45,22.35 45,21.9 R8.2 | 45.45,22.35 46.5,23.4 46.5,23.7 U$16.5 | 45.45,22.35 45.45,20.85 | 45.45,20.85 45.45,17.1 R9.2 | 45.45,20.85 42.15,20.85 | 42.15,20.85 v34.5,20.85 | 66.75,33 62.55,33 61.8,33.75 49.8,33.75 42.15,26.1 42.15,20.85
  Top 0.406: 91.95,28.65 91.95,24 v91.65,23.7
  Top 0.813: 99.15,20.85 100.95,20.85 | v94.5,19.95 98.1,19.95 99.15,21
  Bottom 0.203: v26.25,28.5 26.85,28.5 v34.5,20.85
  Bottom 0.813: v91.65,23.7 91.65,19.95 v94.5,19.95
  pour Top (no thermals): 92.7,28.5 92.7,27.6 86.1,27.6 84.15,25.65 81.15,25.65 81.15,26.7 80.4,26.7 80.4,27.45 81.45,27.45 81.9,26.55 83.4,26.55 85.8,28.95 93.6,28.95
ADC0
  Top 0.203: U$7.8 26.4,22.05 24.75,20.4 20.85,20.4 19.95,19.5 | 19.95,19.5 17.85,19.5 R3.2 17.85,19.35 16.95,18.45 16.95,14.25 20.1,11.1 J8.P$4 | 19.95,19.5 C12.2
ADC1
  Top 0.203: 22.8,16.35 21.75,16.35 21,15.6 | 22.8,16.35 24.9,16.35 26.85,18.3 26.85,22.5 U$7.9 | 21,15.6 18.9,15.6 R2.2 | 21,15.6 C13.2 | 22.8,16.35 22.8,10.5 23.55,9.75 23.55,3.45 J8.P$5
ADC2  (via drill 0.3)
  Top 0.203: 24.75,19.5 22.65,19.5 R6.2 | v27.45,21 27.45,22.5 U$7.10 | v25.95,19.5 24.75,19.5 | 24.75,19.5 C14.2
  Bottom 0.203: J8.P$9 37.5,3.45 37.05,3.9 37.05,11.4 v27.45,21 v25.95,19.5
ADC3
  Top 0.203: U$7.11 27.9,21.45 28.05,21.3 28.05,20.7 27.6,20.25 27.45,20.25 27.3,20.1 27.3,17.1 26.7,16.5 | 25.8,15.6 26.7,16.5 | 25.8,15.6 23.7,15.6 R11.2 | 25.8,15.6 C15.2 | J8.P$10 39.75,3.45 32.7,10.5 28.5,10.5 26.7,12.3 26.7,16.5
ADC4
  Top 0.203: 28.2,19.5 28.5,19.8 28.5,22.5 U$7.12 | 28.2,19.5 29.1,19.5 | 29.1,19.5 30.3,19.5 C16.2 | 28.2,19.5 R12.2 | 29.1,19.5 29.1,16.95 28.35,16.2 28.35,13.2 28.65,12.9 30.45,12.9 31.35,11.85 32.85,11.85 39.6,4.95 53.7,4.95 J16.P$4
ADC5
  Top 0.203: 31.35,15.6 31.35,19.95 29.1,22.2 29.1,23.4 U$7.13 | 31.35,15.6 29.25,15.6 R17.2 | 31.35,15.6 C17.2 31.35,15.45 32.25,14.55 32.25,14.1 36.75,9.6 51.3,9.6 57.45,3.45 J16.P$5
ADC6  (via drill 0.3)
  Top 0.203: v30.9,22.5 29.55,23.85 29.1,23.85 U$7.14 | C28.2 35.1,19.35 v34.05,19.35 33,19.35 R23.2
  Bottom 0.203: v30.9,22.5 v34.05,19.35 34.05,18.6 57.9,18.6 62.4,14.1 62.4,10.5 65.55,10.5 72.6,3.45 J16.P$9
ADC7
  Top 0.203: 34.05,15.6 33.6,15.6 32.1,17.1 32.1,19.8 31.5,20.4 31.5,22.8 30,24.3 29.1,24.3 U$7.15 | 34.05,15.6 36.15,15.6 C29.2 36.15,15.45 41.1,10.5 61.5,10.5 63.3,8.7 69,8.7 74.25,3.45 J16.P$10 | 34.05,15.6 R24.2
ADC8
  Top 0.203: U$7.16 30,24.9 32.4,22.5 | 32.4,22.5 32.4,21.9 C30.2 | 32.4,22.5 33.3,22.5 33.9,23.1 38.1,23.1 54.75,39.75 57.45,39.75 58.65,40.95 J15.P$5
ADC9
  Top 0.203: U$7.17 29.1,25.35 31.05,25.35 32.4,24 C31.2 32.55,24 33.75,25.2 39.45,25.2 J15.P$4
ADC10
  Top 0.203: U$7.18 29.1,25.95 32.25,25.95 32.4,26.1 C32.2 32.55,26.1 33.75,27.3 34.95,27.3 41.1,33.45 J14.P$10
ADC11
  Top 0.203: U$7.19 30.6,26.4 32.4,28.2 C33.2 32.55,28.2 33.75,29.4 34.8,29.4 36.75,31.35 36.75,40.2 37.5,40.95 J14.P$9
ADC12
  Top 0.203: U$7.20 29.4,27.3 32.4,30.3 C34.2 32.55,30.3 33.3,31.05 33.3,33 25.35,40.95 J14.P$5
ADC13
  Top 0.203: U$7.21 27.9,27.9 30.6,30.6 | 30.6,30.6 32.4,32.4 C35.2 | J14.P$4 30.45,30.6 30.6,30.6
ADC16
  Top 0.203: 86.7,22.05 87.75,23.1 R18.1 | 86.7,22.05 82.05,17.4 81.15,17.4 IC2.30 | 86.7,22.05 87.75,21 R19.1
BATT+
  Top 0.203: 96.45,29.25 U3.3 | 96.45,28.8 U3.2 | R18.2 91.5,23.1 92.55,22.05 96.9,22.05 97.2,22.35 97.2,28.8 | 98.4,28.8 C22.1 | 113.4,31.95 J4.2 | J2.P$9 107.7,40.95 | 101.85,28.8 C25.1
  Top 0.406: 96.45,29.25 96.45,28.8 97.2,28.8
  Top 0.813: 97.2,28.8 98.4,28.8 101.85,28.8 104.92,31.88 107.7,31.88 | J6.VIN0 115.2,18.75 112.95,21.15 112.95,31.5 | 113.4,31.95 112.95,31.5 | 112.95,31.5 112.58,31.88 107.7,31.88 | 107.7,40.95 107.7,31.88
D3~  (via drill 0.3)
  Top 0.203: v75.75,22.35 75.75,19.8 IC2.43 | v87.15,33.75 87.75,33.75 93.75,39.75 95.85,39.75 97.05,40.95 J2.P$6
  Bottom 0.203: v87.15,33.75 v75.75,22.35
D12~
  Top 0.203: J1.P$3 85.28,3.45 84.13,4.6 81.75,4.6 75.7,10.5 75.7,12.6 IC2.13
D13~
  Top 0.203: IC2.14 76.2,12.6 76.05,12.45 76.05,10.8 82.05,4.95 88.65,4.95 J1.P$4
D14~
  Top 0.203: J1.P$8 102.75,3.45 100.65,5.55 82.05,5.55 76.5,10.95 76.5,12.3 76.65,12.45 76.65,12.9 IC2.15
D15~  (via drill 0.3)
  Top 0.203: v85.95,8.7 79.5,8.7 77.2,10.94 77.15,10.99 77.15,12.23 77.2,12.28 IC2.16
  Bottom 0.203: v85.95,8.7 104.25,27 104.25,40.95 J2.P$8
DTR  (via drill 0.3)
  Top 0.203: v99,15 99.3,15.3 100.05,15.3 U2.18 | v79.5,5.1 78.75,5.1 73.35,10.5 73.35,11.55 C43.2
  Bottom 0.203: v99,15 89.1,5.1 v79.5,5.1
EXT_3.3V  (via drill 0.3)
  Top 0.203: 13.05,3.45 J8.P$2 | v57.6,18 58.2,18.6 60.9,18.6 RTC1.2 | v64.05,4.8 v58.95,9.9 | v61.5,33.15 60.75,32.4 59.85,32.4 F1.2
  Top 0.305: 28.35,43.2 16.95,43.2 13.05,39.3 13.05,33.45 9.9,30.3 9.9,21 13.05,17.85 13.05,3.45 | J14.P$7 28.35,43.2 | J2.P$4 88.5,40.95 86.55,42.9 67.5,42.9 | J15.P$7 67.5,42.9 | 67.5,42.9 51.9,42.9 51.6,43.2 28.35,43.2 | J8.P$2 15,3.45 17.55,0.9 28.05,0.9 | J8.P$7 28.05,0.9 | v98.1,0.75 68.4,0.75 J16.P$7 63.15,0.9 28.05,0.9
  Bottom 0.203: v57.6,18 57.6,14.55 58.5,13.65 58.5,12.45 58.95,12 v58.95,9.9 | v64.05,4.8 64.35,4.8 J16.P$7 | v61.5,33.15 61.5,36.75 J15.P$7
  Bottom 0.305: v98.1,0.75 98.1,2.5 J1.P$6
EXT_5V  (via drill 0.3)
  Top 0.203: 34.05,3.45 J8.P$8 | 69.15,3.45 J16.P$8 69.3,3.45 | 82.65,31.95 F2.2 | 34.05,40.95 J14.P$8 | 69.15,40.95 J15.P$8 69.3,40.95 | 51.6,40.95 J15.P$3 | 16.5,3.45 J8.P$3 | v15.9,25.8 18.9,25.8 R22.2
  Top 0.305: J8.P$3 18,3.45 19.8,1.5 27.15,1.5 28.8,3.15 28.8,3.45 30,4.65 32.85,4.65 34.05,3.45 | J1.P$7 98.85,3.45 96.75,1.35 71.4,1.35 69.3,3.45 67.26,3.45 66.16,4.55 65.24,4.55 63.04,2.35 37.14,2.35 36.04,3.45 J8.P$8 | 82.65,31.95 84.45,31.95 87.45,34.95 | 87.45,34.95 93.45,40.95 J2.P$5 | J14.P$3 17.7,40.95 19.35,42.6 27.9,42.6 29.25,41.25 29.25,40.35 30,39.6 32.7,39.6 34.05,40.95 | J15.P$3 53.1,40.95 54.3,42.15 63.3,42.15 64.05,41.4 64.05,40.5 64.95,39.75 67.95,39.75 69.15,40.95 | J14.P$8 35.1,40.95 36.75,42.6 45.3,42.6 46.8,41.1 46.8,40.35 47.55,39.6 50.25,39.6 51.6,40.95 | 87.45,34.95 80.85,41.55 80.85,41.85 80.55,42.15 70.5,42.15 69.3,40.95 | 16.5,3.45 16.5,13.5 14.85,15.15 v14.85,25.8
  Bottom 0.203: 16.5,40.95 J14.P$3 | v14.85,25.8 v15.9,25.8
  Bottom 0.305: v14.85,25.8 14.85,39.3 16.5,40.95
GND  (via drill 0.3)
  Top 0.203: 23.39,24.9 U$7.EXP | 23.39,24.9 23.25,24.9 | 23.25,28.95 23.32,29.02 23.4,29.02 | 24.15,29.85 24.15,30.45 24.3,30.6 24.45,30.6 24.75,30.3 | 22.2,25.95 U$7.33 23.39,25.9 | 24.75,30.3 C18.2 23.4,30.1 23.4,29.02 | 24.75,30.3 24.75,30.22 | 77.7,13.84 IC2.TH 77.7,13.84 77.91,13.63 78.1,13.44 78.1,13.12 IC2.18 | U$7.6 25.4,24.65 U$7.EXP | U$7.1 22.87,22.62 22.87,22.95 24.97,24.9 U$7.EXP | U$7.4 24.37,23.07 25.42,24.15 25.65,24.08 U$7.EXP | 23.4,29.02 U$7.30 23.39,25.9 | 23.39,25.9 23.39,24.9 | 35.25,16.95 35.22,16.95 | v29.4,37.8 v32.25,37.8 | v15.6,38.85 15.6,38.55 15.15,38.1 15.15,31.2 C3.2 | v67.5,34.95 v67.5,36.9 | v55.65,24.9 v57.45,24.9
  Bottom 0.203: v29.4,37.8 20.25,37.8 19.2,38.85 v15.6,38.85 | v57.45,24.9 v67.5,34.95 | v55.65,22.35 v55.65,24.9
  other vias: 78.6,11.4 86.25,24.6 85.5,22.8 103.05,12.15 67.65,33 60.3,22.2 19.5,39.15 16.8,22.2 25.95,18.45 22.05,5.4 30.3,16.65 37.65,17.25 75.3,25.5 80.1,38.7 26.1,31.05 36.15,29.55 43.95,38.1 36.75,24 36.6,21.9 113.85,11.1 89.55,19.65 47.7,28.05 64.35,27.75 21.75,21.75 46.35,6.15 74.7,39.3
  pour Top (rank 2): 121.41,-0.53 -0.25,-0.53 -0.25,44.86 121.41,44.86
  pour Bottom: -0.5,44.5 123,44.5 123,-1.5 -0.5,-1.5
LED+1
  Top 0.203: LED3.A R_LED1.2
MANUAL_LOG  (via drill 0.3)
  Top 0.203: v82.35,15.3 81.15,15.3 IC2.26 | v83.55,15.3 84.6,15.3 84.75,15.15 89.25,15.15 D1.2
  Bottom 0.203: v83.55,15.3 v82.35,15.3
MCU_ADC0  (via drill 0.3)
  Top 0.203: v78.75,21 78.75,19.8 IC2.37
  Bottom 0.203: J2.P$7 100.5,40.95 98.55,39 93.3,39 80.1,25.8 80.1,22.35 v78.75,21
MISO/D6  (via drill 0.3)
  Top 0.203: IC2.2 74.28,18.45 73.97,18.45 73.77,18.64 73.77,18.93 71.4,21.3 71.4,21.32 71.2,21.53 71.2,26.1 70.95,26.35 70.8,26.35 | 70.8,26.35 59.85,26.35 56.26,29.94 52.06,29.94 50.99,28.88 | 50.99,28.88 ISP2.1 | 70.8,26.35 v70.8,26.1 | v43.65,14.55 44.4,14.55 46.35,16.5 46.35,19.05 v47.7,20.4 | v51.45,24.15 51.45,28.35 51,28.8 50.99,28.88
  Bottom 0.203: J15.P$10 76.2,31.5 v70.8,26.1 | v43.65,14.55 SD.7 | v51.45,24.15 v47.7,20.4
MOSI/D5  (via drill 0.3)
  Top 0.203: IC2.1 71.55,21.68 71.55,26.25 71.1,26.7 60,26.7 56.34,30.36 54.6,30.36 53.53,31.42 ISP2.4 | J2.P$1 77.7,40.95 71.1,34.35 v53.25,34.35 | v44.1,27.15 49.95,33 v50.7,33
  Bottom 0.203: v53.25,34.35 53.25,32.4 52.5,31.65 | 52.5,31.65 ISP2.4 52.5,31.5 | v44.1,27.15 41.1,27.15 SD.2 | v50.7,33 52.05,31.65 52.5,31.65
N$1
  Top 0.203: 72.15,29.1 72.3,29.1 U$3.7
  pour Top (no thermals): 72.15,29.1 69.9,29.1 69.9,28.2 71.1,28.2 71.1,28.5
N$2
  Top 0.203: RN1.1 97.95,13.8 LED2.A
N$3
  Top 0.203: RN1.4 97.8,16.2 LED1.A
N$4
  Top 0.203: RN1.3 96.45,15.45 98.55,15.45 99,15.9 100.05,15.9 U2.17
N$5
  Top 0.203: IC2.40 77.25,19.8 77.25,20.1 77.4,20.25 77.4,23.25 77.25,23.4 R_LED1.1
N$6
  Top 0.203: Q5.1 64.95,30.15 65.55,30.15 U$12.4
N$7  (via drill 3.17)
  other vias: 3,41.4
N$8  (via drill 3.17)
  other vias: 117.6,41.4
N$9
  cutout Top: 63.6,24.9 69.6,24.9 69.6,11.7 63.6,11.7
N$10  (via drill 3.17)
  other vias: 117.6,3
N$11
  Top 0.203: 99.15,22.65 98.85,22.95 98.85,25.2 Q11.3 | 99.15,22.65 100.95,22.65 Q12.1 | 99.15,22.65 R14.2
N$12  (via drill 3.17)
  other vias: 3,3
N$13
  cutout Bottom: 63.45,25.05 69.75,25.05 69.75,11.55 63.45,11.55
N$14
  Top 0.203: U$1.4 81.75,23.85 81.75,25.2 Q10.1
N$15
  cutout Top: 94.65,26.55 94.05,27 95.85,27 95.25,26.55 95.25,22.35 94.65,22.35
N$16
  Top 0.203: U$7.7 25.8,22.5 25.8,22.05 24.6,20.85 20.7,20.85 18.9,22.65 R25.2 R22.1
N$17
  Top 0.203: Q5.3 60.6,30.3 59.85,29.55 F1.1
N$18  (via drill 0.3)
  Top 0.203: v30.3,13.95 29.25,13.95 R17.1 | v27.75,16.5 27.75,17.25 28.2,17.7 R12.1 | v34.05,16.65 33,17.7 R23.1 | 34.5,14.4 34.05,13.95 R24.1 | 34.5,14.4 v35.1,15 | 34.5,14.4 v32.85,14.4 | SJ2.2 28.14,12.21 v27.75,12.6
  Bottom 0.203: v30.3,13.95 v27.75,16.5 | v34.05,16.65 34.05,16.05 v35.1,15 | v30.3,13.95 32.4,13.95 v32.85,14.4 | v27.75,12.6 28.95,12.6 v30.3,13.95
N$19
  Top 0.203: U$16.4 45.15,23.7 43.05,23.7 Q7.1
N$20
  Top 0.406: F2.1 Q10.3
N$21
  Top 0.203: U3.6 93.45,30.3 93.45,32.25 C21.1
N$22
  Top 0.203: U3.8 91.35,29.25 90.75,29.85 C23.1 90.75,30 88.5,30 | 88.5,30 87,31.5 86.25,31.5 R16.1 | 88.5,30 R15.2
N$24
  Top 0.203: R3.1 17.85,16.8 | 17.85,16.8 17.85,15 18.9,13.95 R2.1 18.9,13.8 20.55,12.15 20.55,4.95 21.75,3.75 21.75,3 22.8,1.95 24.6,1.95 25.2,2.55 25.2,10.95 23.7,12.45 | 23.7,12.45 R11.1 | 17.85,16.8 20.55,16.8 21.45,17.7 22.65,17.7 R6.1 | SJ1.2 23.7,12.45
N$25
  Top 0.203: D+.2 CX3.2 111.15,13.8 112.35,12.6 113.4,12.6 114.6,11.4 114.6,11.25 114.9,10.95 MICRO_USB.3
N$26
  Top 0.203: D-.2 CX2.2 111.15,11.7 112.5,10.35 115.95,10.35 MICRO_USB.2
N$27
  pour Top (no thermals): 96.15,28.2 96.15,26.85 95.55,26.25 95.55,22.5 96.75,22.5 96.75,28.2
N$28
  Top 0.203: U2.8 104.25,15.3 106.5,15.3 108,13.8 D+.1
N$29  (via drill 0.3)
  Top 0.203: v99.6,13.5 98.55,14.55 96.45,14.55 RN1.2 | v100.8,12.45 100.8,13.05 101.1,13.35 U2.1
  Bottom 0.203: v99.6,13.5 100.65,12.45 v100.8,12.45
N$30  (via drill 0.3)
  Top 0.203: U2.10 103.65,16.95 | 103.65,16.95 U2.11 | 100.2,13.8 100.2,11.4 C40.1 | 100.2,13.8 100.2,14.4 U2.20 | v103.8,17.1 103.65,16.95 | 100.2,13.8 v100.5,13.8
  Bottom 0.203: v100.5,13.8 v103.8,17.1
N$32
  pour Top (no thermals): 93.15,28.2 93.15,22.5 94.35,22.5 94.35,26.25 93.75,26.85 93.75,28.2
N$33
  Top 0.203: LED2.C 97.95,12 99.45,10.5 102.6,10.5 105,12.9 105,14.7 104.85,14.85 104.25,14.85 U2.7
N$35
  Top 0.203: LED1.C 97.8,18 100.65,18 100.95,18.3 101.4,18.3 101.7,18 101.7,17.55 U2.14
N$36
  Top 0.203: U2.9 104.25,15.9 105.75,15.9 107.55,17.7 110.7,17.7 110.85,17.55 110.85,14.85 110.7,14.7 109.2,14.7 108.9,14.4 108.9,12.45 108.15,11.7 D-.1
N$37  (via drill 0.3)
  Top 0.203: C7.1 53.25,20.25 55.2,20.25 55.35,20.1 RTC1.6 55.5,19.95 56.4,19.05 v56.4,18 | v59.1,13.35 58.35,13.35 v55.05,16.65
  Bottom 0.203: v56.4,18 v55.05,16.65 | v59.1,13.35 60.75,11.7 60.75,11.4 | 60.75,11.4 60.75,10.8 55.65,5.7 50.85,5.7 45.75,10.8 45.75,11.4 CLOCK_BATT.POWER0 | 60.75,11.4 CLOCK_BATT.POWER1
N$39  (via drill 0.3)
  Top 0.203: S1.P$2 10.95,14.4 10.95,18.3 S1.P$1 10.8,18.45 9.3,19.95 9.3,37.8 10.8,39.3 10.8,40.2 14.4,43.8 99.3,43.8 101.85,41.25 101.85,40.65 99.9,38.7 v99.9,29.7 | v97.8,27.6 97.8,22.35 97.05,21.6 94.2,21.6 92.25,19.65 92.25,16.8 D1.3
  Bottom 0.203: v99.9,29.7 v97.8,27.6
N$40
  Top 0.203: C3.1 17.7,31.2 18.3,31.8 18.6,31.8 U$2.1
N$52
  Top 0.203: U$7.24 U$7.25
N$130
  Top 0.203: U$7.26 U$7.27
PSYNC  (via drill 0.3)
  Top 0.203: v76.35,24.9 76.35,22.8 76.95,22.2 76.95,20.4 76.65,20.1 76.65,19.8 IC2.41 | v79.8,28.35 82.2,30.75 83.85,30.75 86.25,33.15 95.85,33.15 97.2,31.8 97.2,30.15 96.9,29.85 96.45,29.85 U3.4
  Bottom 0.203: v79.8,28.35 v76.35,24.9
RST  (via drill 0.3)
  Top 0.203: U$4.P$3 10.8,28.65 | 10.8,28.65 U$4.P$4 10.8,25.5 | 10.8,28.65 15.9,28.65 | 15.9,28.65 16.2,28.65 R1.1 15.9,28.65 | v73.2,17.4 74.25,17.4 IC2.4 | v73.05,14.25 73.05,13.95 71.7,12.6 71.7,11.55 C43.1 | v62.25,16.95 63.75,18.45 63.75,22.65 63.45,22.95 62.7,22.95 56.85,28.8 55.05,28.8 ISP2.5 | 15.9,28.65 15.9,38.25 19.8,42.15 27.45,42.15 28.65,40.95 28.65,40.05 29.7,39 34.05,39 37.2,42.15 41.4,42.15 45.9,37.65 v50.85,37.65
  Bottom 0.203: 73.2,16.35 73.2,14.4 v73.05,14.25 | 73.2,16.35 v73.2,17.4 | v62.25,16.95 62.85,16.35 73.2,16.35 | v50.85,37.65 56.55,31.95 56.55,30.6 54.9,28.95 ISP2.5
RTC_INT  (via drill 0.3)
  Top 0.203: IC2.42 76.2,20.55 v76.35,20.7 | v86.4,17.7 89.85,17.7 D1.1 | v63.15,20.1 61.05,20.1 RTC1.3 | v71.7,20.1 70.65,20.1 70.2,19.65 v70.05,19.65
  Bottom 0.203: v86.4,17.7 84.75,19.35 78,19.35 76.65,20.7 v76.35,20.7 74.85,20.7 74.25,20.1 v71.7,20.1 | v63.15,20.1 69.6,20.1 v70.05,19.65
RX/INT0  (via drill 0.3)
  Top 0.203: v78.45,6.3 74.4,10.35 74.4,13.8 IC2.11 | v77.55,5.4 79.5,3.45 J1.P$1
  Bottom 0.203: v77.55,5.4 v78.45,6.3
RX_USB  (via drill 0.3)
  Top 0.203: v94.05,15.45 94.95,15.45 RN1.6 | v91.5,12.9 82.95,12.9 v80.1,10.05 | v71.85,13.65 71.85,13.95 72.75,14.85 IC2.9
  Bottom 0.203: v91.5,12.9 v94.05,15.45 | v80.1,10.05 79.8,9.75 75.75,9.75 v71.85,13.65
SCK/D7  (via drill 0.3)
  Top 0.203: IC2.3 73.65,17.85 73.05,18.45 v72.3,18.45
  Bottom 0.203: v72.3,18.45 71.55,18.45 70.95,19.05 62.4,19.05 56.55,24.9 | 53.85,27.6 52.5,28.95 ISP2.3 | 53.85,27.6 56.55,24.9 | 56.55,24.9 72.6,40.95 J15.P$9 | 53.85,27.6 53.85,27.45 46.05,19.65 41.1,19.65 SD.5
SCL  (via drill 0.3)
  Top 0.203: R42.1 50.55,13.05 50.55,14.7 Q9.2 53.25,17.4 55.35,17.4 RTC1.8 55.5,17.4 59.7,17.4 v63,14.1 | v80.1,11.1 78.75,12.45 78.75,12.9 IC2.19 | v81.75,9.45 96.45,9.45 99.6,6.3 100.5,6.3 102.15,4.65 106.35,4.65 107.55,3.45 J1.P$9 | v47.7,19.2 47.7,18.15 48,17.85 48,15.45 v47.7,15.15
  Bottom 0.203: v81.75,9.45 v80.1,11.1 79.68,11.1 79.13,10.55 78.07,10.55 77.52,11.1 76.8,11.1 75.75,12.15 74.25,12.15 71.85,14.55 70.5,13.2 70.5,11.55 69.9,10.95 63.45,10.95 63,11.4 v63,14.1 57.9,19.2 v47.7,19.2 | J14.P$1 9.6,32.4 14.55,27.45 21,27.45 | 21,27.45 33.3,39.75 43.5,39.75 J15.P$1 | 44.1,3.45 42.6,3.45 41.4,4.65 40.35,4.65 37.95,2.25 37.2,2.25 21,18.45 21,27.45 | v47.7,15.15 45.15,15.15 44.1,14.1 44.1,3.45 | 44.1,3.45 J16.P$1
SCL_HV  (via drill 0.3)
  Top 0.203: v23.4,21.6 U$7.2 | v36.15,19.95 37.35,19.95 43.35,13.95 44.4,13.95 46.2,15.75 | 46.2,15.75 47.1,16.65 47.1,17.1 R9.1 | v49.65,15.9 Q9.3 | 46.2,15.75 v47.85,14.1
  Bottom 0.203: v23.4,21.6 24.9,23.1 31.2,23.1 33.75,20.55 33.75,20.25 34.05,19.95 v36.15,19.95 | v47.85,14.1 v49.65,15.9
SD_CS  (via drill 0.3)
  Top 0.203: v81.9,14.4 81.15,14.4 IC2.24 | v63.15,21.15 60.75,23.55 50.25,23.55 v49.2,24.6
  Bottom 0.203: v81.9,14.4 77.85,18.45 73.35,18.45 72.45,19.35 71.55,19.35 69.75,21.15 v63.15,21.15 | v49.2,24.6 44.25,29.55 SD.1
SD_VCC  (via drill 0.3)
  Top 0.203: v40.95,23.25 40.95,24.6 Q7.3
  Bottom 0.203: v40.95,23.25 40.95,22.2 SD.4
SD_VCC_CTRL  (via drill 0.3)
  Top 0.203: v86.85,16.95 84.3,16.95 82.95,15.6 82.95,14.1 81.15,12.3 80.1,12.3 79.65,12.75 79.65,12.9 IC2.21 | v62.85,22.35 62.55,22.35 58.35,26.55 v52.05,26.55 | v48,26.7 47.55,26.7 U$16.1
  Bottom 0.203: v86.85,16.95 86.85,17.25 87,17.4 87,18 84.6,20.4 77.55,20.4 76.2,21.75 73.2,21.75 72.6,22.35 v62.85,22.35 | v52.05,26.55 48.15,26.55 v48,26.7
SDA  (via drill 0.3, 0.35)
  Top 0.203: 50.55,18.75 50.55,18.6 R43.1 50.55,18.75 | 50.55,18.75 50.55,20.25 Q8.2 50.7,20.4 50.7,21 52.65,22.95 60.6,22.95 62.25,21.3 v62.25,21.15 | 50.55,18.75 55.35,18.75 RTC1.7 | IC2.20 79.2,12.6 79.95,11.85 81.3,11.85 83.1,13.65 85.2,13.65 | 85.2,13.65 92.85,13.65 97.95,8.55 98.85,8.55 102.3,5.1 109.5,5.1 J1.P$10 | v74.55,19.5 v72.3,21.75 | 85.2,13.65 v85.2,14.55 | v70.5,21.75 70.5,25.2 v70.05,25.65
  Bottom 0.203: v62.25,21.15 62.25,25.95 69.75,25.95 | v74.55,19.5 77.25,19.5 77.85,18.9 80.85,18.9 v85.2,14.55 | v70.5,21.75 70.65,21.9 72.15,21.9 v72.3,21.75 | 69.75,25.95 v70.05,25.65 | J16.P$2 50.1,3.45 51.3,4.65 52.05,4.65 52.8,3.9 52.8,3 51.45,1.65 34.35,1.65 8.4,27.6 8.4,41.85 8.7,42.15 11.85,42.15 13.05,40.95 J14.P$2 15,40.95 16.2,42.15 46.95,42.15 48.15,40.95 J15.P$2 50.1,40.95 51.3,42.15 73.05,42.15 73.8,41.4 73.8,30 69.75,25.95
SDA_HV  (via drill 0.3)
  Top 0.203: v24.45,21.6 24,22.05 24,22.5 U$7.3 | v50.55,17.25 50.1,17.7 49.95,17.7 49.65,18 Q8.3 49.65,22.5 49.2,22.95 v49.2,23.7 | R8.1 46.65,21.9 46.65,22.2 48,23.55 v48,23.7
  Bottom 0.203: v24.45,21.6 30,21.6 35.85,15.75 48.6,15.75 50.1,17.25 v50.55,17.25 | v49.2,23.7 v48,23.7
SS/D4  (via drill 0.3)
  Top 0.203: v74.4,22.8 75.15,22.05 75.15,19.8 IC2.44
  Bottom 0.203: v74.4,22.8 74.4,29.1 83.25,37.95 83.25,40.95 J2.P$2
TX/INT1
  Top 0.203: IC2.12 75.3,12.93 75.3,10.25 82.35,3.45 J1.P$2
TX_USB  (via drill 0.3)
  Top 0.2: 95.1,14.61 95.1,14.55
  Top 0.203: 95.4,14.55 95.1,14.55 RN1.7 | IC2.10 74.28,14.25 73.97,14.25 73.77,14.06 73.77,13.76 72.45,12.45 v72.45,10.05 | v91.95,12 83.25,12 80.55,9.3 v80.58,9.31 | v94.23,14.61 95.1,14.61
  Bottom 0.203: v72.45,10.05 73.5,9.15 80.4,9.15 v80.58,9.31 | v91.95,12 94.23,14.28 v94.23,14.61
VUSB  (via drill 0.3)
  Top 0.203: 102.6,24.3 100.95,24.3 Q11.1 | 103.05,21.75 103.05,23.85 102.6,24.3 | 102.6,24.3 R20.2 | 102.75,19.05 102.75,17.55 U2.12 | 103.05,21.75 102.75,21.45 | Q12.3 103.05,21.75 | 95.1,16.2 RN1.5 | 115.2,9.45 MICRO_USB.1 | 95.1,13.8 RN1.8
  Top 0.254: 102.75,21.45 102.75,19.05 97.2,19.05 95.1,16.95 95.1,16.2 | 107.85,9.45 98.55,9.45 95.1,12.9 95.1,13.8
  Top 0.813: 115.2,9.45 107.85,9.45 106.05,11.25 v106.05,11.55 | v106.05,18.9 103.2,21.75 Q12.3
  Bottom 0.813: v106.05,11.55 v106.05,18.9
XTAL1
  Top 0.203: Q3.1 68.87,13.47 C42.1 74.33,15.4 IC2.8
XTAL2
  Top 0.203: Q3.2 66.6,20.9 C41.1 71.3,16.2 71.4,16.2 71.76,15.85 IC2.7

### Text on the board
bPlace: ALog BottleLogger v3.0.0 / ---------------------- / Open-source scientific / data logger / ---------------------- / Made in Minnesota | TM | Open-source for the outdoors | TM | Developed in part at the / University of Minnesota in / parntnership with / Northern Widget LLC
tDocu: SCL | SDA | 5V | A13 | A12 | GND | 3V3 | 5V | A11 | A10 | SCL | SDA | 5V | A9 | A8 | GND | 3V3 | 5V | SCK | MISO | MOSI | SS/D4~ | GND | 3V3 | 5V | D3~ | ADC0 | D15~ | BATT | GND | RESET | LOG | RX/INT0 | TX/INT1 | D12~ | D13~ | GND | 3V3 | 5V | D14~ | SCL | SDA | GND | 3V3 | 5V | A0 | A1 | GND | 3V3 | 5V | A2 | A3 | SCL | SDA | GND | A4 | A5 | GND | 3V3 | 5V | A6 | A7